# EAGLE schematic cft (EAGLE 5.11), part 3 of 7
## Sheet 21 of 49
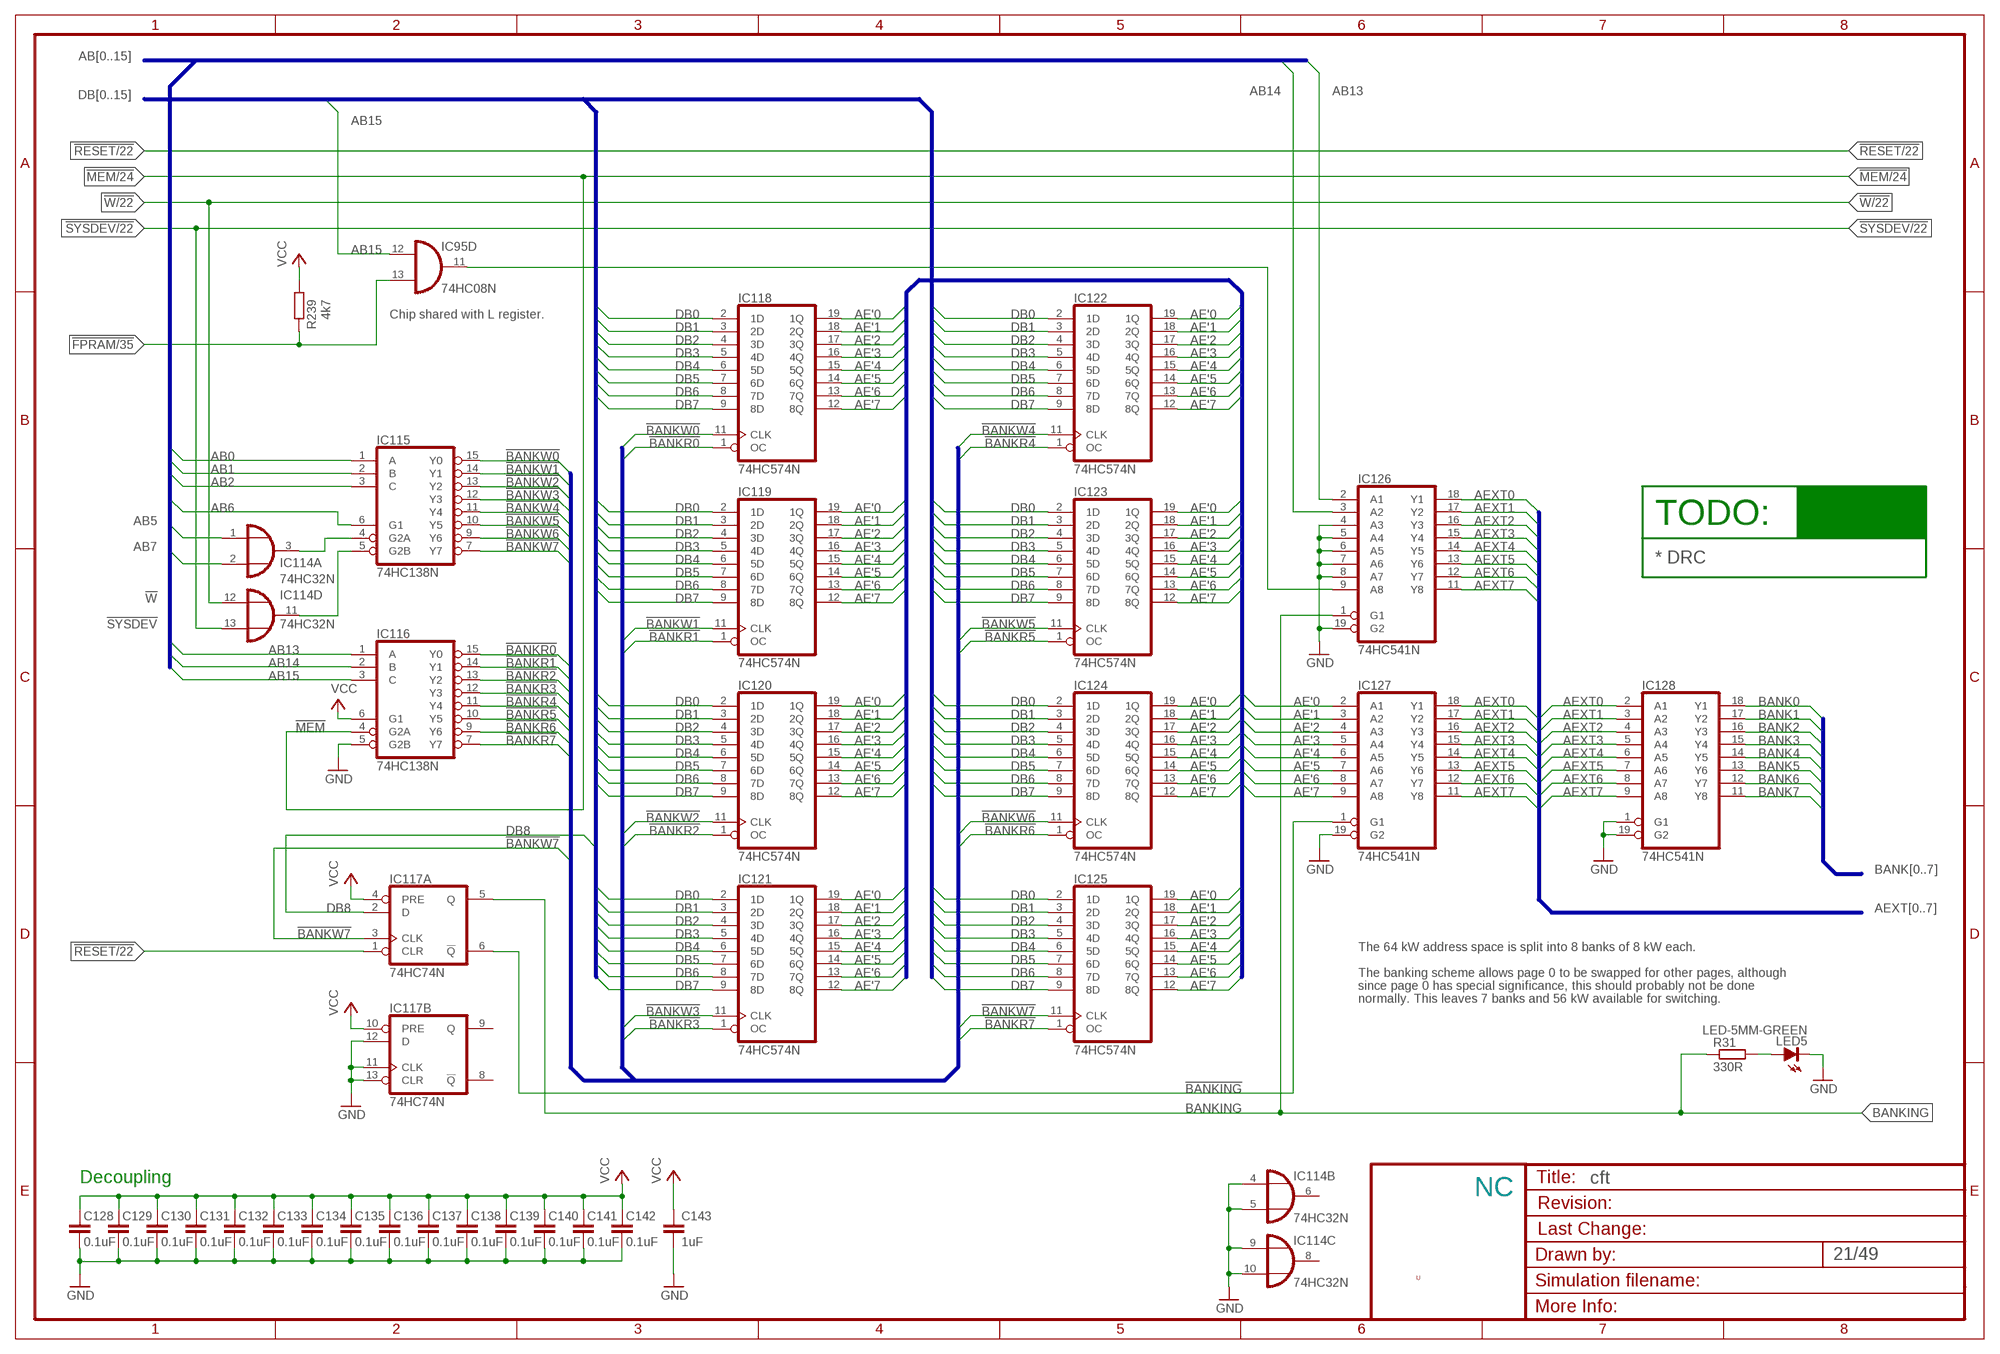
[diagram p20: schematic, sheet 21]

### Parts
C128  0.1uF  C-EU025-024X044  [C025-024X044]
C129  0.1uF  C-EU025-024X044  [C025-024X044]
C130  0.1uF  C-EU025-024X044  [C025-024X044]
C131  0.1uF  C-EU025-024X044  [C025-024X044]
C132  0.1uF  C-EU025-024X044  [C025-024X044]
C133  0.1uF  C-EU025-024X044  [C025-024X044]
C134  0.1uF  C-EU025-024X044  [C025-024X044]
C135  0.1uF  C-EU025-024X044  [C025-024X044]
C136  0.1uF  C-EU025-024X044  [C025-024X044]
C137  0.1uF  C-EU025-024X044  [C025-024X044]
C138  0.1uF  C-EU025-024X044  [C025-024X044]
C139  0.1uF  C-EU025-024X044  [C025-024X044]
C140  0.1uF  C-EU025-024X044  [C025-024X044]
C141  0.1uF  C-EU025-024X044  [C025-024X044]
C142  0.1uF  C-EU025-024X044  [C025-024X044]
C143  1uF  C-EU025-024X044  [C025-024X044]
IC114  74HC32N  [DIL14]
IC115  74HC138N  [DIL16]
IC116  74HC138N  [DIL16]
IC117  74HC74N  [DIL14]
IC118  74HC574N  [DIL20]
IC119  74HC574N  [DIL20]
IC120  74HC574N  [DIL20]
IC121  74HC574N  [DIL20]
IC122  74HC574N  [DIL20]
IC123  74HC574N  [DIL20]
IC124  74HC574N  [DIL20]
IC125  74HC574N  [DIL20]
IC126  74HC541N  [DIL20]
IC127  74HC541N  [DIL20]
IC128  74HC541N  [DIL20]
LED5  LED-5MM-GREEN  [LED5MM]
R31  330R  R-EU_0204/7  [0204/7]
R239  4k7  R-EU_0204/7  [0204/7]

### Nets
!BANKING: IC117.6(A:!Q) IC127.1(G1)
!BANKR0: IC116.15(Y0) IC118.1(OC)
!BANKR1: IC116.14(Y1) IC119.1(OC)
!BANKR2: IC116.13(Y2) IC120.1(OC)
!BANKR3: IC116.12(Y3) IC121.1(OC)
!BANKR4: IC116.11(Y4) IC122.1(OC)
!BANKR5: IC116.10(Y5) IC123.1(OC)
!BANKR6: IC116.9(Y6) IC124.1(OC)
!BANKR7: IC116.7(Y7) IC125.1(OC)
!BANKW0: IC115.15(Y0) IC118.11(CLK)
!BANKW1: IC115.14(Y1) IC119.11(CLK)
!BANKW2: IC115.13(Y2) IC120.11(CLK)
!BANKW3: IC115.12(Y3) IC121.11(CLK)
!BANKW4: IC115.11(Y4) IC122.11(CLK)
!BANKW5: IC115.10(Y5) IC123.11(CLK)
!BANKW6: IC115.9(Y6) IC124.11(CLK)
!BANKW7: IC115.7(Y7) IC117.3(A:CLK) IC125.11(CLK)
!FPRAM: IC95.13(D:I1) R239.1 ; also sheet 35,40
!MEM: IC116.4(G2A) ; also sheet 4,5,6,12,13,24,42,44,45,46
!RESET: IC117.1(A:CLR) ; also sheet 2,3,4,7,8,10,11,12,13,14,17,18,19,20,22,25,26,28,29,30,31,44,45,46,47
!SYSDEV: IC114.13(D:I1) ; also sheet 13,22,25,26,27,28,29,30,41,44,45,46
!W: IC114.12(D:I0) ; also sheet 12,22,24,25,26,27,28,29,30,41,44,45,46,47,48
AB0: IC115.1(A) ; also sheet 13,24,25,26,27,28,29,30,41,44,45,46,47,48
AB1: IC115.2(B) ; also sheet 13,24,25,26,27,28,29,30,41,44,45,46,47,48
AB2: IC115.3(C) ; also sheet 13,24,25,26,27,29,30,41,44,45,46,47,48
AB5: IC114.1(A:I0) ; also sheet 13,22,24,25,26,27,28,29,30,41,44,45,46,47,48
AB6: IC115.6(G1) ; also sheet 13,22,24,25,26,27,28,29,30,41,44,45,46,47,48
AB7: IC114.2(A:I1) ; also sheet 13,22,24,25,26,27,28,29,30,41,44,45,46,47,48
AB13: IC116.1(A) IC126.2(A1) ; also sheet 13,44,45,46
AB14: IC116.2(B) IC126.3(A2) ; also sheet 13,44,45,46
AB15: IC95.12(D:I0) IC116.3(C) ; also sheet 13,44,45,46
AE'0: IC118.19(1Q) IC119.19(1Q) IC120.19(1Q) IC121.19(1Q) IC122.19(1Q) IC123.19(1Q) IC124.19(1Q) IC125.19(1Q) IC127.2(A1)
AE'1: IC118.18(2Q) IC119.18(2Q) IC120.18(2Q) IC121.18(2Q) IC122.18(2Q) IC123.18(2Q) IC124.18(2Q) IC125.18(2Q) IC127.3(A2)
AE'2: IC118.17(3Q) IC119.17(3Q) IC120.17(3Q) IC121.17(3Q) IC122.17(3Q) IC123.17(3Q) IC124.17(3Q) IC125.17(3Q) IC127.4(A3)
AE'3: IC118.16(4Q) IC119.16(4Q) IC120.16(4Q) IC121.16(4Q) IC122.16(4Q) IC123.16(4Q) IC124.16(4Q) IC125.16(4Q) IC127.5(A4)
AE'4: IC118.15(5Q) IC119.15(5Q) IC120.15(5Q) IC121.15(5Q) IC122.15(5Q) IC123.15(5Q) IC124.15(5Q) IC125.15(5Q) IC127.6(A5)
AE'5: IC118.14(6Q) IC119.14(6Q) IC120.14(6Q) IC121.14(6Q) IC122.14(6Q) IC123.14(6Q) IC124.14(6Q) IC125.14(6Q) IC127.7(A6)
AE'6: IC118.13(7Q) IC119.13(7Q) IC120.13(7Q) IC121.13(7Q) IC122.13(7Q) IC123.13(7Q) IC124.13(7Q) IC125.13(7Q) IC127.8(A7)
AE'7: IC118.12(8Q) IC119.12(8Q) IC120.12(8Q) IC121.12(8Q) IC122.12(8Q) IC123.12(8Q) IC124.12(8Q) IC125.12(8Q) IC127.9(A8)
AEXT0: IC126.18(Y1) IC127.18(Y1) IC128.2(A1) ; also sheet 24,44,45,46
AEXT1: IC126.17(Y2) IC127.17(Y2) IC128.3(A2) ; also sheet 24,44,45,46
AEXT2: IC126.16(Y3) IC127.16(Y3) IC128.4(A3) ; also sheet 24,44,45,46
AEXT3: IC126.15(Y4) IC127.15(Y4) IC128.5(A4) ; also sheet 24,44,45,46
AEXT4: IC126.14(Y5) IC127.14(Y5) IC128.6(A5) ; also sheet 24,44,45,46
AEXT5: IC126.13(Y6) IC127.13(Y6) IC128.7(A6) ; also sheet 24,44,45,46
AEXT6: IC126.12(Y7) IC127.12(Y7) IC128.8(A7) ; also sheet 24,44,45,46
AEXT7: IC126.11(Y8) IC127.11(Y8) IC128.9(A8) ; also sheet 24,44,45,46
BANK0: IC128.18(Y1) ; also sheet 32
BANK1: IC128.17(Y2) ; also sheet 32
BANK2: IC128.16(Y3) ; also sheet 32
BANK3: IC128.15(Y4) ; also sheet 32
BANK4: IC128.14(Y5) ; also sheet 32
BANK5: IC128.13(Y6) ; also sheet 32
BANK6: IC128.12(Y7) ; also sheet 32
BANK7: IC128.11(Y8) ; also sheet 32
BANKING: IC117.5(A:Q) IC126.1(G1) R31.1 ; also sheet 32
DB0: IC118.2(1D) IC119.2(1D) IC120.2(1D) IC121.2(1D) IC122.2(1D) IC123.2(1D) IC124.2(1D) IC125.2(1D) ; also sheet 12,22,24,25,26,27,28,29,30,31,41,44,45,46,47,48
DB1: IC118.3(2D) IC119.3(2D) IC120.3(2D) IC121.3(2D) IC122.3(2D) IC123.3(2D) IC124.3(2D) IC125.3(2D) ; also sheet 12,22,24,25,26,27,28,29,30,31,41,44,45,46,47,48
DB2: IC118.4(3D) IC119.4(3D) IC120.4(3D) IC121.4(3D) IC122.4(3D) IC123.4(3D) IC124.4(3D) IC125.4(3D) ; also sheet 12,22,24,25,26,27,28,29,30,31,41,44,45,46,47,48
DB3: IC118.5(4D) IC119.5(4D) IC120.5(4D) IC121.5(4D) IC122.5(4D) IC123.5(4D) IC124.5(4D) IC125.5(4D) ; also sheet 12,22,24,25,26,27,28,29,30,31,41,44,45,46,47,48
DB4: IC118.6(5D) IC119.6(5D) IC120.6(5D) IC121.6(5D) IC122.6(5D) IC123.6(5D) IC124.6(5D) IC125.6(5D) ; also sheet 12,22,24,25,26,27,28,29,30,31,41,44,45,46,47,48
DB5: IC118.7(6D) IC119.7(6D) IC120.7(6D) IC121.7(6D) IC122.7(6D) IC123.7(6D) IC124.7(6D) IC125.7(6D) ; also sheet 12,22,24,25,26,27,28,29,30,31,41,44,45,46,47,48
DB6: IC118.8(7D) IC119.8(7D) IC120.8(7D) IC121.8(7D) IC122.8(7D) IC123.8(7D) IC124.8(7D) IC125.8(7D) ; also sheet 12,22,24,25,26,27,28,29,30,31,41,44,45,46,47,48
DB7: IC118.9(8D) IC119.9(8D) IC120.9(8D) IC121.9(8D) IC122.9(8D) IC123.9(8D) IC124.9(8D) IC125.9(8D) ; also sheet 12,22,24,25,26,27,28,29,30,31,41,44,45,46,47,48
DB8: IC117.2(A:D) ; also sheet 12,24,26,27,29,30,31,41,44,45,46,48
GND [low power]: C128.1 C129.1 C130.1 C131.1 C132.1 C133.1 C134.1 C135.1 C136.1 C137.1 C138.1 C139.1 C140.1 C141.1 C142.1 C143.2 IC114.4(B:I0) IC114.5(B:I1) IC114.9(C:I0) IC114.10(C:I1) IC116.5(G2B) IC117.11(B:CLK) IC117.12(B:D) IC117.13(B:CLR) IC126.4(A3) IC126.5(A4) IC126.6(A5) IC126.7(A6) IC126.8(A7) IC126.19(G2) IC127.19(G2) IC128.1(G1) IC128.19(G2) LED5.K(C) ; also sheet 2,3,4,5,6,7,8,9,10,11,12,13,14,15,16,17,18,19,20,22,24,25,26,27,28,29,30,31,32,33,34,35,36,37,38,39,40,41,42,43,44,45,46,47,48,49
N$339: IC114.3(A:O) IC115.4(G2A)
N$340: IC114.11(D:O) IC115.5(G2B)
N$341: LED5.A R31.2
N$919: IC95.11(D:O) IC126.9(A8)
VCC [low power]: C128.2 C129.2 C130.2 C131.2 C132.2 C133.2 C134.2 C135.2 C136.2 C137.2 C138.2 C139.2 C140.2 C141.2 C142.2 C143.1 IC116.6(G1) IC117.4(A:PRE) IC117.10(B:PRE) R239.2 ; also sheet 2,3,4,6,7,8,9,10,11,12,13,14,15,16,17,18,19,20,22,24,25,26,27,28,29,30,31,34,35,36,37,38,39,40,41,42,43,44,45,46,47,48,49
Unconnected: IC114.6(B:O) IC114.8(C:O) IC117.8(B:!Q) IC117.9(B:Q)

### Buses
AB[0..15]
DB[0..15]
AE'[0..7]
AEXT[0..7]
BANK[0..7]
!BANKW[0..7],!BANKR[0..7],!BANKEN

### Notes on the sheet
- Chip shared with L register.
- TODO:
- * DRC
- The 64 kW address space is split into 8 banks of 8 kW each.
- The banking scheme allows page 0 to be swapped for other pages, although
- since page 0 has special significance, this should probably not be done
- normally. This leaves 7 banks and 56 kW available for switching.
- Decoupling
- NC
- U

## Sheet 22 of 49
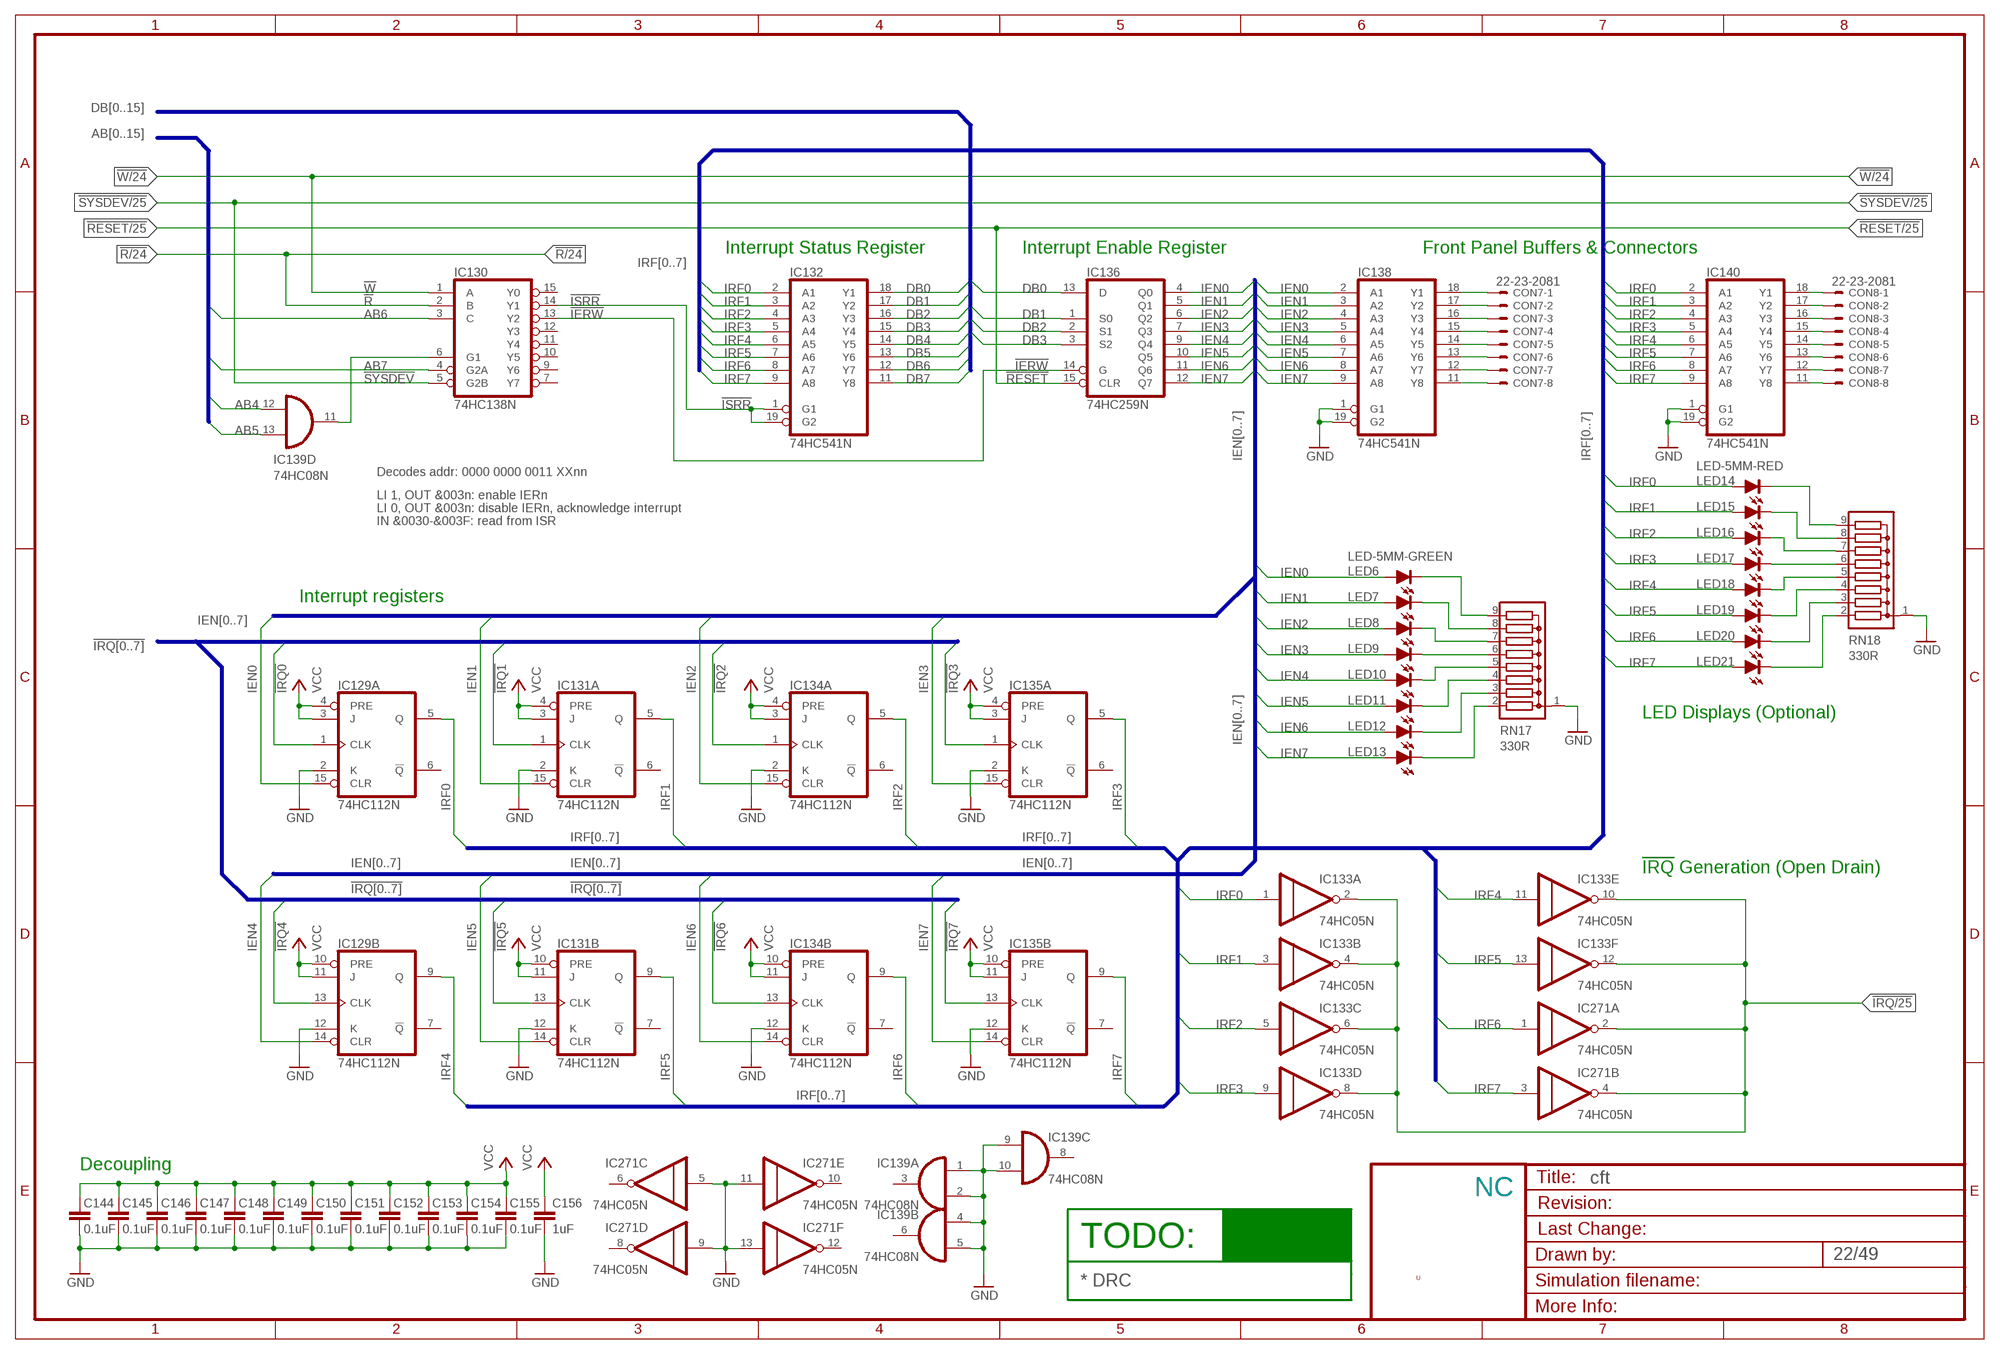
[diagram p21: schematic, sheet 22]

### Parts
C144  0.1uF  C-EU025-024X044  [C025-024X044]
C145  0.1uF  C-EU025-024X044  [C025-024X044]
C146  0.1uF  C-EU025-024X044  [C025-024X044]
C147  0.1uF  C-EU025-024X044  [C025-024X044]
C148  0.1uF  C-EU025-024X044  [C025-024X044]
C149  0.1uF  C-EU025-024X044  [C025-024X044]
C150  0.1uF  C-EU025-024X044  [C025-024X044]
C151  0.1uF  C-EU025-024X044  [C025-024X044]
C152  0.1uF  C-EU025-024X044  [C025-024X044]
C153  0.1uF  C-EU025-024X044  [C025-024X044]
C154  0.1uF  C-EU025-024X044  [C025-024X044]
C155  0.1uF  C-EU025-024X044  [C025-024X044]
C156  1uF  C-EU025-024X044  [C025-024X044]
CON7  22-23-2081  [22-23-2081]
CON8  22-23-2081  [22-23-2081]
IC129  74HC112N  [DIL16]
IC130  74HC138N  [DIL16]
IC131  74HC112N  [DIL16]
IC132  74HC541N  [DIL20]
IC133  74HC05N  [DIL14]
IC134  74HC112N  [DIL16]
IC135  74HC112N  [DIL16]
IC136  74HC259N  [DIL16]
IC138  74HC541N  [DIL20]
IC139  74HC08N  [DIL14]
IC140  74HC541N  [DIL20]
IC271  74HC05N  [DIL14]
LED6  LED-5MM-GREEN  [LED5MM]
LED7  LED-5MM-GREEN  [LED5MM]
LED8  LED-5MM-GREEN  [LED5MM]
LED9  LED-5MM-GREEN  [LED5MM]
LED10  LED-5MM-GREEN  [LED5MM]
LED11  LED-5MM-GREEN  [LED5MM]
LED12  LED-5MM-GREEN  [LED5MM]
LED13  LED-5MM-GREEN  [LED5MM]
LED14  LED-5MM-RED  [LED5MM]
LED15  LED-5MM-RED  [LED5MM]
LED16  LED-5MM-RED  [LED5MM]
LED17  LED-5MM-RED  [LED5MM]
LED18  LED-5MM-RED  [LED5MM]
LED19  LED-5MM-RED  [LED5MM]
LED20  LED-5MM-RED  [LED5MM]
LED21  LED-5MM-RED  [LED5MM]
RN17  330R  G08R  [SIL9]
RN18  330R  G08R  [SIL9]

### Nets
!IERW: IC130.13(Y2) IC136.14(G)
!IRQ: IC133.2(A:O) IC133.4(B:O) IC133.6(C:O) IC133.8(D:O) IC133.10(E:O) IC133.12(F:O) IC271.2(A:O) IC271.4(B:O) ; also sheet 11,25,26,27,28,29,30,44,47
!IRQ0: IC129.1(A:CLK) ; also sheet 25,27,30,44,45,46
!IRQ1: IC131.1(A:CLK) ; also sheet 25,27,30,44,45,46
!IRQ2: IC134.1(A:CLK) ; also sheet 25,27,29,30,44,45,46,47
!IRQ3: IC135.1(A:CLK) ; also sheet 25,29,30,44,45,46,47
!IRQ4: IC129.13(B:CLK) ; also sheet 25,29,30,44,45,46,47
!IRQ5: IC131.13(B:CLK) ; also sheet 25,26,28,30,44,45,46
!IRQ6: IC134.13(B:CLK) ; also sheet 25,26,28,30,44,45,46
!IRQ7: IC135.13(B:CLK) ; also sheet 25,26,28,30,44,45,46
!ISRR: IC130.14(Y1) IC132.1(G1) IC132.19(G2)
!R: IC130.2(B) ; also sheet 4,5,6,12,24,25,26,27,28,29,30,41,42,44,45,46,47,48
!RESET: IC136.15(CLR) ; also sheet 2,3,4,7,8,10,11,12,13,14,17,18,19,20,21,25,26,28,29,30,31,44,45,46,47
!SYSDEV: IC130.5(G2B) ; also sheet 13,21,25,26,27,28,29,30,41,44,45,46
!W: IC130.1(A) ; also sheet 12,21,24,25,26,27,28,29,30,41,44,45,46,47,48
AB4: IC139.12(D:I0) ; also sheet 13,24,25,26,27,28,29,30,41,44,45,46,47,48
AB5: IC139.13(D:I1) ; also sheet 13,21,24,25,26,27,28,29,30,41,44,45,46,47,48
AB6: IC130.3(C) ; also sheet 13,21,24,25,26,27,28,29,30,41,44,45,46,47,48
AB7: IC130.4(G2A) ; also sheet 13,21,24,25,26,27,28,29,30,41,44,45,46,47,48
DB0: IC132.18(Y1) IC136.13(D) ; also sheet 12,21,24,25,26,27,28,29,30,31,41,44,45,46,47,48
DB1: IC132.17(Y2) IC136.1(S0) ; also sheet 12,21,24,25,26,27,28,29,30,31,41,44,45,46,47,48
DB2: IC132.16(Y3) IC136.2(S1) ; also sheet 12,21,24,25,26,27,28,29,30,31,41,44,45,46,47,48
DB3: IC132.15(Y4) IC136.3(S2) ; also sheet 12,21,24,25,26,27,28,29,30,31,41,44,45,46,47,48
DB4: IC132.14(Y5) ; also sheet 12,21,24,25,26,27,28,29,30,31,41,44,45,46,47,48
DB5: IC132.13(Y6) ; also sheet 12,21,24,25,26,27,28,29,30,31,41,44,45,46,47,48
DB6: IC132.12(Y7) ; also sheet 12,21,24,25,26,27,28,29,30,31,41,44,45,46,47,48
DB7: IC132.11(Y8) ; also sheet 12,21,24,25,26,27,28,29,30,31,41,44,45,46,47,48
FPIEN0: CON7.1 IC138.18(Y1)
FPIEN1: CON7.2 IC138.17(Y2)
FPIEN2: CON7.3 IC138.16(Y3)
FPIEN3: CON7.4 IC138.15(Y4)
FPIEN4: CON7.5 IC138.14(Y5)
FPIEN5: CON7.6 IC138.13(Y6)
FPIEN6: CON7.7 IC138.12(Y7)
FPIEN7: CON7.8 IC138.11(Y8)
FPIEN8: CON8.1 IC140.18(Y1)
FPIEN9: CON8.2 IC140.17(Y2)
FPIEN10: CON8.3 IC140.16(Y3)
FPIEN11: CON8.4 IC140.15(Y4)
FPIEN12: CON8.5 IC140.14(Y5)
FPIEN13: CON8.6 IC140.13(Y6)
FPIEN14: CON8.7 IC140.12(Y7)
FPIEN15: CON8.8 IC140.11(Y8)
GND [low power]: C144.1 C145.1 C146.1 C147.1 C148.1 C149.1 C150.1 C151.1 C152.1 C153.1 C154.1 C155.1 C156.2 IC129.2(A:K) IC129.12(B:K) IC131.2(A:K) IC131.12(B:K) IC134.2(A:K) IC134.12(B:K) IC135.2(A:K) IC135.12(B:K) IC138.1(G1) IC138.19(G2) IC139.1(A:I0) IC139.2(A:I1) IC139.4(B:I0) IC139.5(B:I1) IC139.9(C:I0) IC139.10(C:I1) IC140.1(G1) IC140.19(G2) IC271.5(C:I) IC271.9(D:I) IC271.11(E:I) IC271.13(F:I) RN17.1 RN18.1 ; also sheet 2,3,4,5,6,7,8,9,10,11,12,13,14,15,16,17,18,19,20,21,24,25,26,27,28,29,30,31,32,33,34,35,36,37,38,39,40,41,42,43,44,45,46,47,48,49
IEN0: IC129.15(A:CLR) IC136.4(Q0) IC138.2(A1) LED6.A
IEN1: IC131.15(A:CLR) IC136.5(Q1) IC138.3(A2) LED7.A
IEN2: IC134.15(A:CLR) IC136.6(Q2) IC138.4(A3) LED8.A
IEN3: IC135.15(A:CLR) IC136.7(Q3) IC138.5(A4) LED9.A
IEN4: IC129.14(B:CLR) IC136.9(Q4) IC138.6(A5) LED10.A
IEN5: IC131.14(B:CLR) IC136.10(Q5) IC138.7(A6) LED11.A
IEN6: IC134.14(B:CLR) IC136.11(Q6) IC138.8(A7) LED12.A
IEN7: IC135.14(B:CLR) IC136.12(Q7) IC138.9(A8) LED13.A
IRF0: IC129.5(A:Q) IC132.2(A1) IC133.1(A:I) IC140.2(A1) LED14.A
IRF1: IC131.5(A:Q) IC132.3(A2) IC133.3(B:I) IC140.3(A2) LED15.A
IRF2: IC132.4(A3) IC133.5(C:I) IC134.5(A:Q) IC140.4(A3) LED16.A
IRF3: IC132.5(A4) IC133.9(D:I) IC135.5(A:Q) IC140.5(A4) LED17.A
IRF4: IC129.9(B:Q) IC132.6(A5) IC133.11(E:I) IC140.6(A5) LED18.A
IRF5: IC131.9(B:Q) IC132.7(A6) IC133.13(F:I) IC140.7(A6) LED19.A
IRF6: IC132.8(A7) IC134.9(B:Q) IC140.8(A7) IC271.1(A:I) LED20.A
IRF7: IC132.9(A8) IC135.9(B:Q) IC140.9(A8) IC271.3(B:I) LED21.A
N$3: LED9.K(C) RN17.6
N$4: LED8.K(C) RN17.7
N$5: LED7.K(C) RN17.8
N$6: LED6.K(C) RN17.9
N$56: LED10.K(C) RN17.5
N$57: LED11.K(C) RN17.4
N$58: LED12.K(C) RN17.3
N$59: LED13.K(C) RN17.2
N$60: LED17.K(C) RN18.6
N$62: LED16.K(C) RN18.7
N$63: LED15.K(C) RN18.8
N$64: LED14.K(C) RN18.9
N$65: LED18.K(C) RN18.5
N$120: LED19.K(C) RN18.4
N$121: LED20.K(C) RN18.3
N$122: LED21.K(C) RN18.2
N$381: IC130.6(G1) IC139.11(D:O)
VCC [low power]: C144.2 C145.2 C146.2 C147.2 C148.2 C149.2 C150.2 C151.2 C152.2 C153.2 C154.2 C155.2 C156.1 IC129.3(A:J) IC129.4(A:PRE) IC129.10(B:PRE) IC129.11(B:J) IC131.3(A:J) IC131.4(A:PRE) IC131.10(B:PRE) IC131.11(B:J) IC134.3(A:J) IC134.4(A:PRE) IC134.10(B:PRE) IC134.11(B:J) IC135.3(A:J) IC135.4(A:PRE) IC135.10(B:PRE) IC135.11(B:J) ; also sheet 2,3,4,6,7,8,9,10,11,12,13,14,15,16,17,18,19,20,21,24,25,26,27,28,29,30,31,34,35,36,37,38,39,40,41,42,43,44,45,46,47,48,49
Unconnected: IC129.6(A:!Q) IC129.7(B:!Q) IC130.7(Y7) IC130.9(Y6) IC130.10(Y5) IC130.11(Y4) IC130.12(Y3) IC130.15(Y0) IC131.6(A:!Q) IC131.7(B:!Q) IC134.6(A:!Q) IC134.7(B:!Q) IC135.6(A:!Q) IC135.7(B:!Q) IC139.3(A:O) IC139.6(B:O) IC139.8(C:O) IC271.6(C:O) IC271.8(D:O) IC271.10(E:O) IC271.12(F:O)

### Buses
AB[0..15]
DB[0..15]
!IRQ[0..7]
IEN[0..7]
IRF[0..7]

### Notes on the sheet
- Interrupt Status Register | Interrupt Enable Register | Front Panel Buffers & Connectors
- Decodes addr: 0000 0000 0011 XXnn
- LI 1, OUT &003n: enable IERn
- LI 0, OUT &003n: disable IERn, acknowledge interrupt
- IN &0030-&003F: read from ISR
- Interrupt registers
- LED Displays (Optional)
- !IRQ! Generation (Open Drain)
- Decoupling
- NC
- TODO:
- U
- * DRC

## Sheet 23 of 49
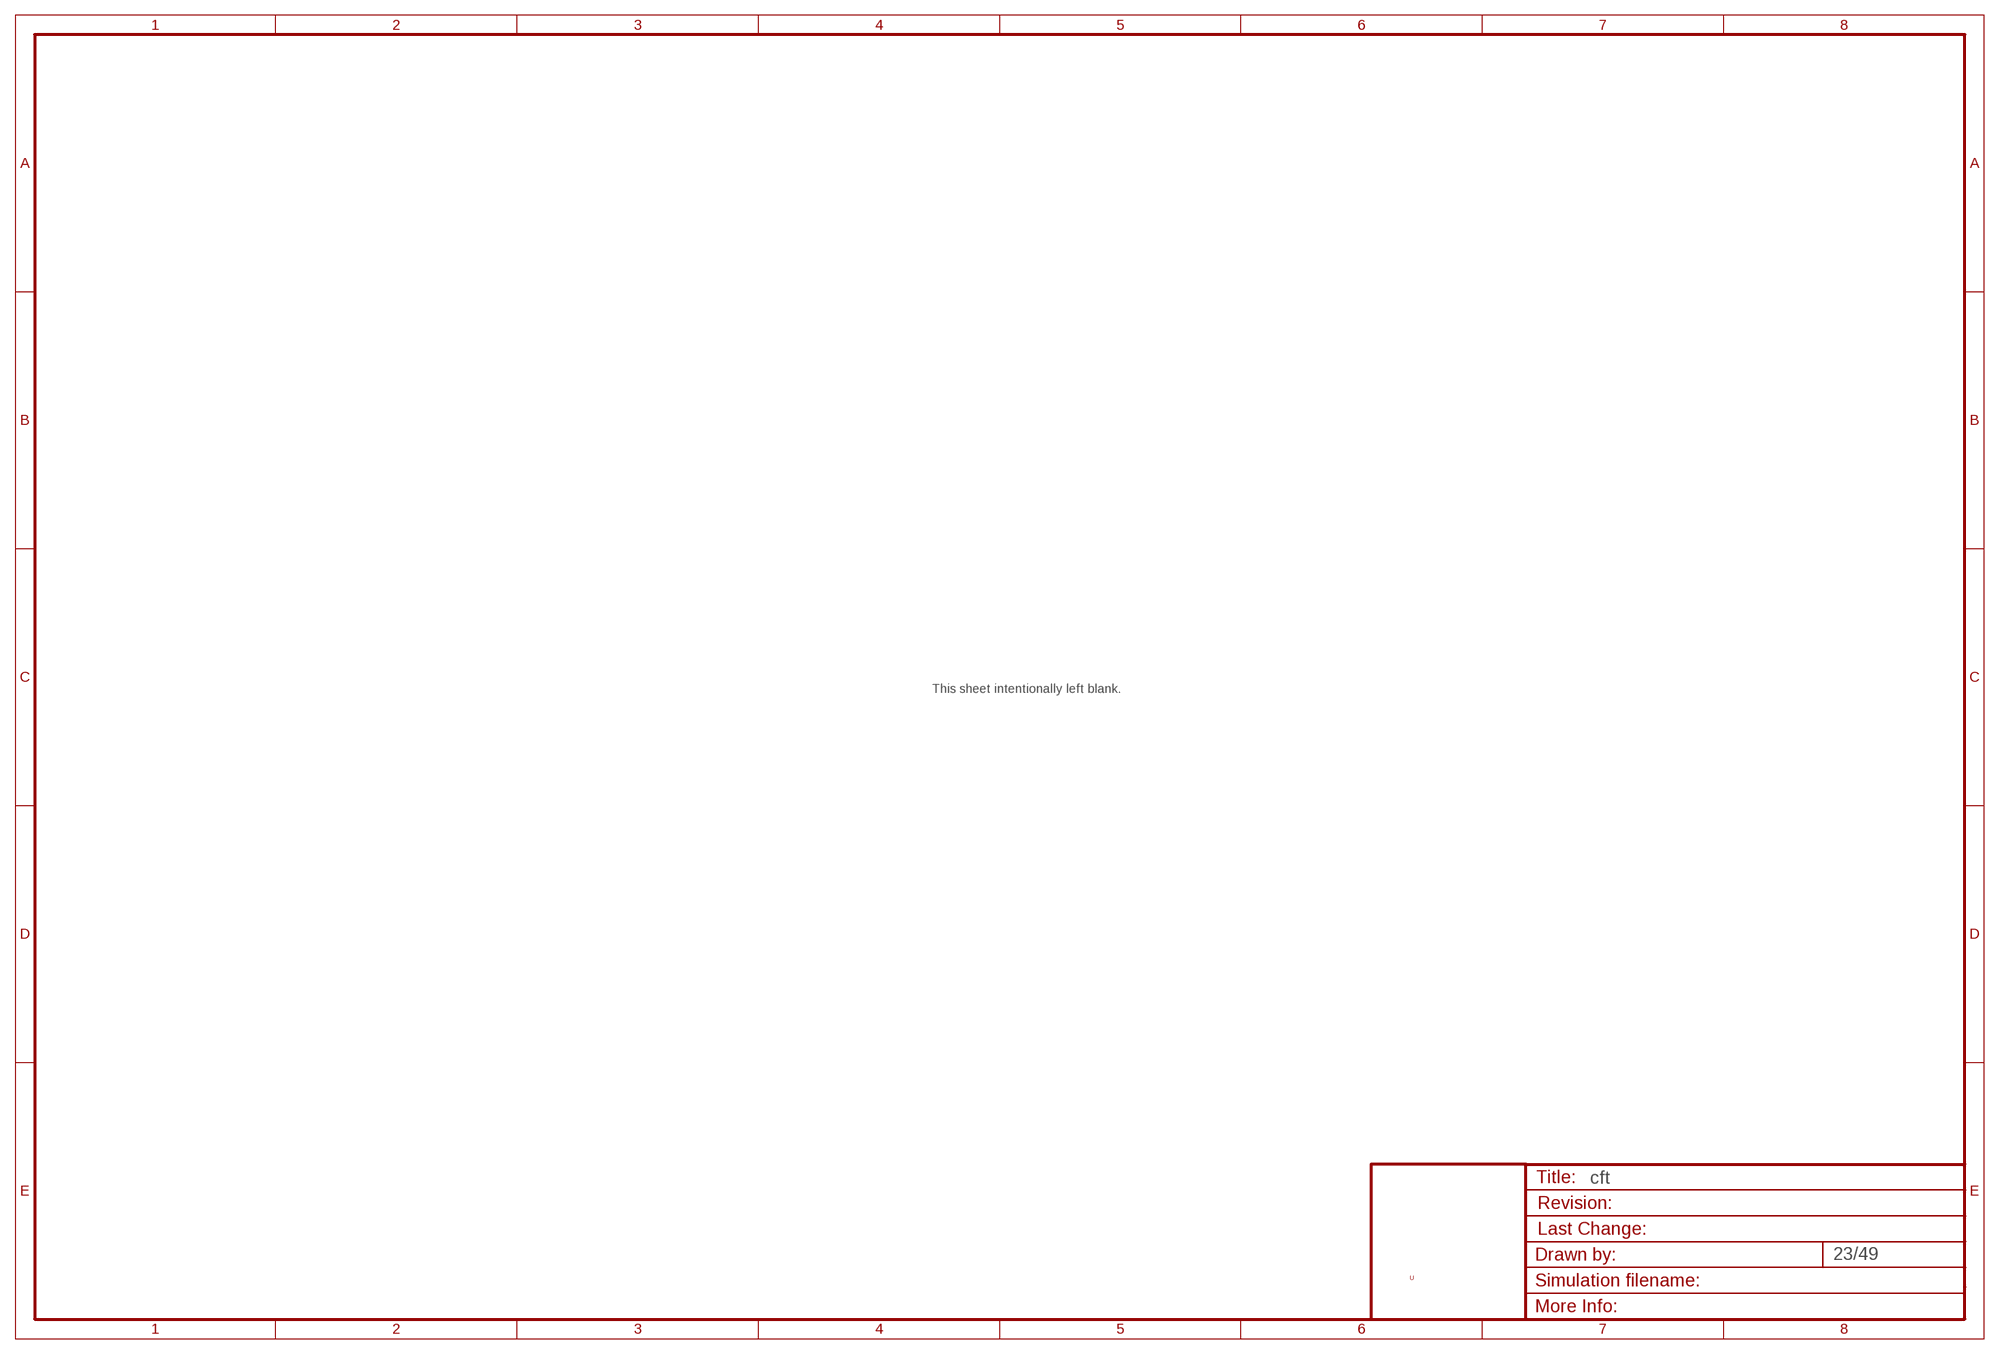
[diagram p22: schematic, sheet 23]

### Notes on the sheet
- This sheet intentionally left blank.
- U

## Sheet 24 of 49
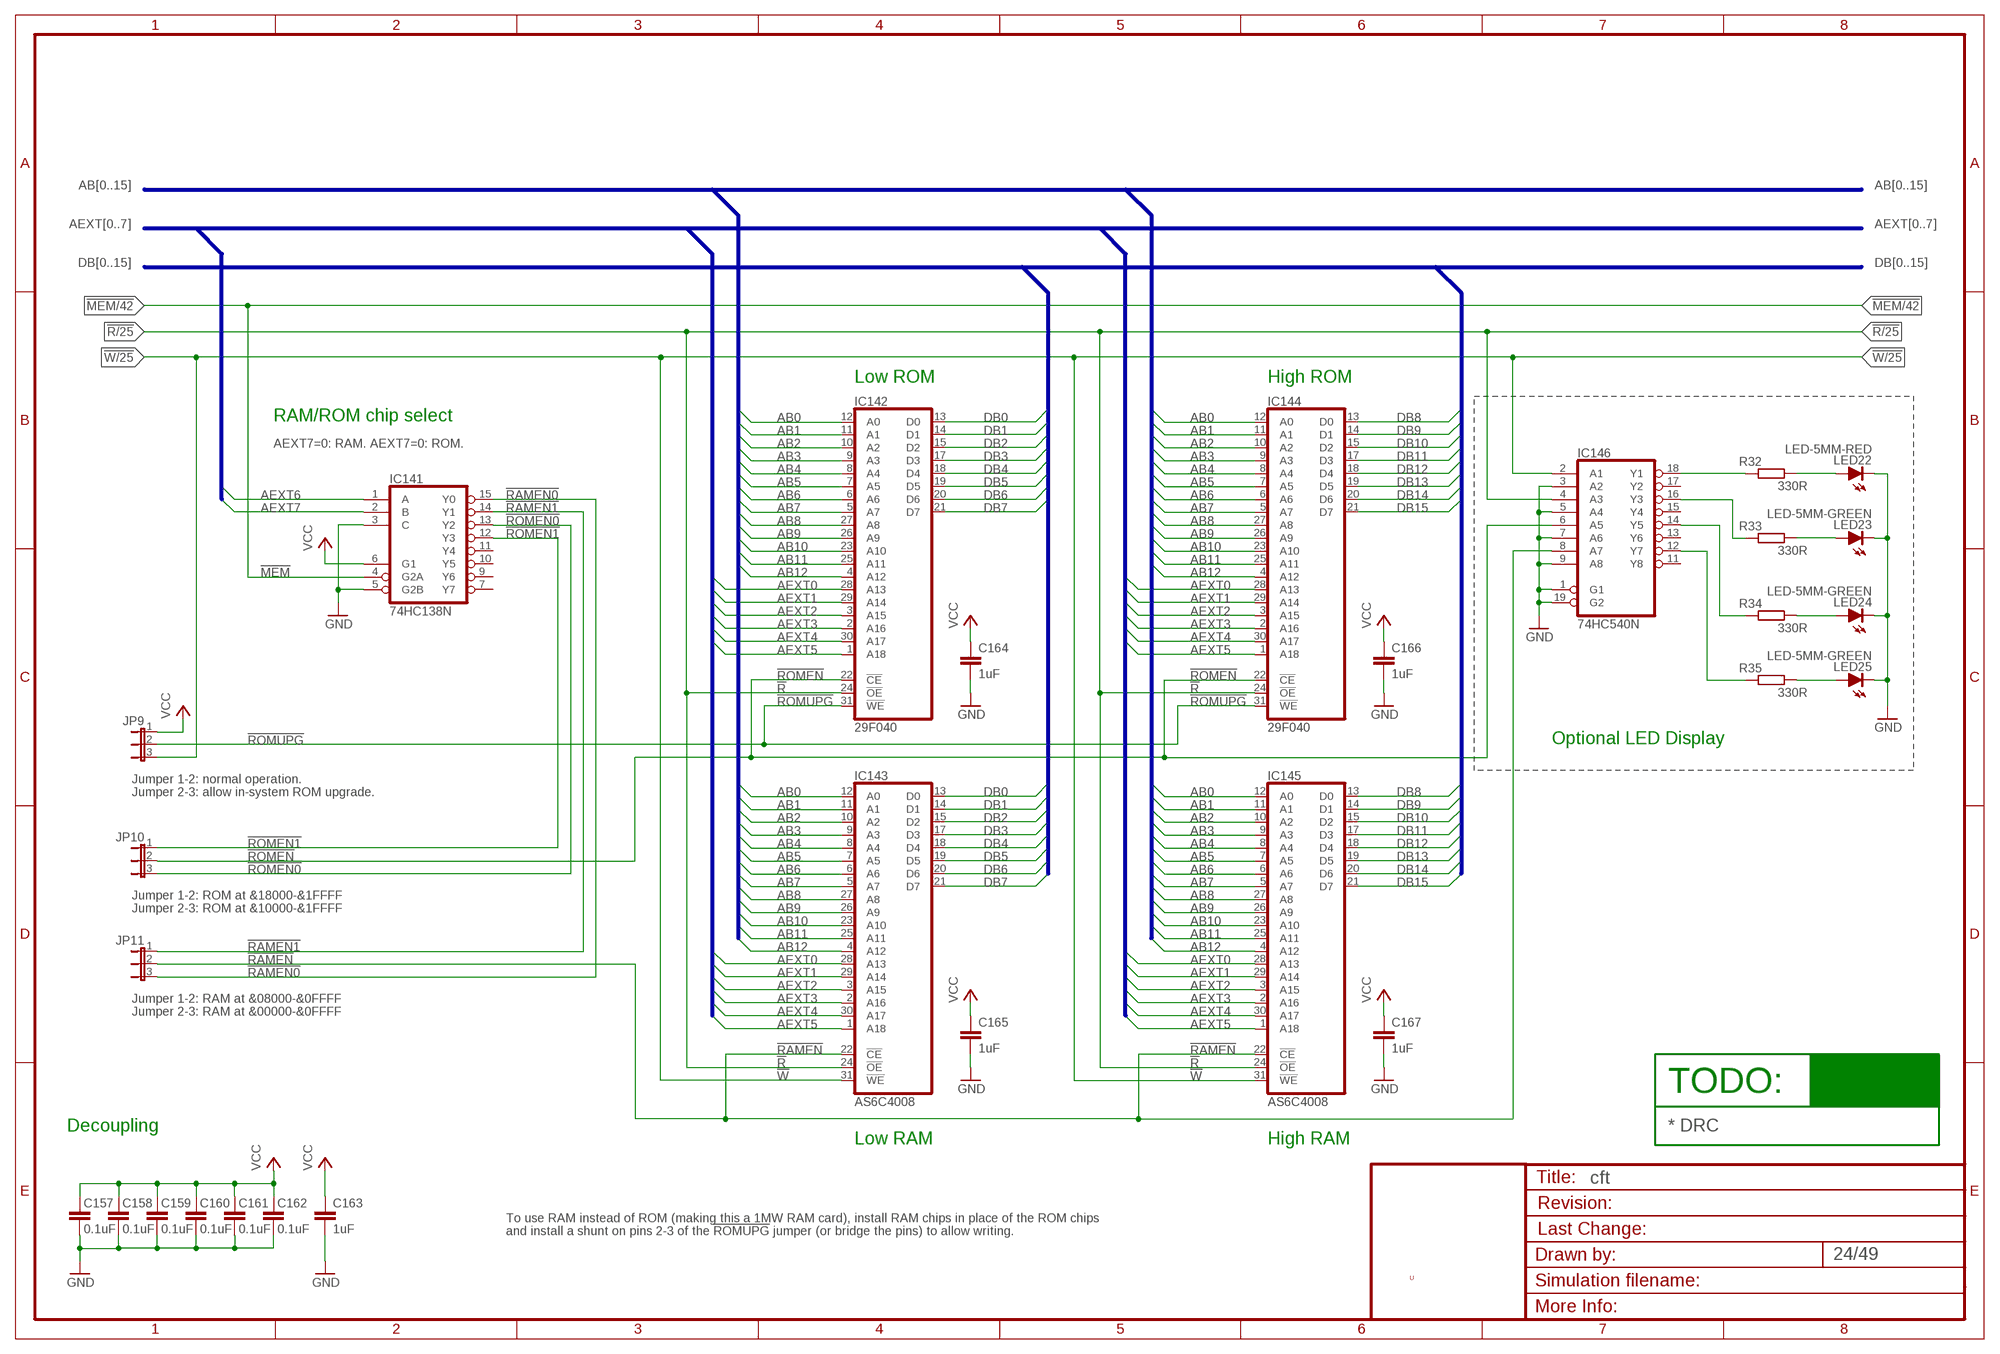
[diagram p23: schematic, sheet 24]

### Parts
C157  0.1uF  C-EU025-024X044  [C025-024X044]
C158  0.1uF  C-EU025-024X044  [C025-024X044]
C159  0.1uF  C-EU025-024X044  [C025-024X044]
C160  0.1uF  C-EU025-024X044  [C025-024X044]
C161  0.1uF  C-EU025-024X044  [C025-024X044]
C162  0.1uF  C-EU025-024X044  [C025-024X044]
C163  1uF  C-EU025-024X044  [C025-024X044]
C164  1uF  C-EU025-024X044  [C025-024X044]
C165  1uF  C-EU025-024X044  [C025-024X044]
C166  1uF  C-EU025-024X044  [C025-024X044]
C167  1uF  C-EU025-024X044  [C025-024X044]
IC141  74HC138N  [DIL16]
IC142  29F040  29F040PLCC32  [PLCC32]
IC143  AS6C4008  29F040DIP32  [DIL32]
IC144  29F040  29F040PLCC32  [PLCC32]
IC145  AS6C4008  29F040DIP32  [DIL32]
IC146  74HC540N  [DIL20]
JP9  JP2E  [JP2]
JP10  JP2E  [JP2]
JP11  JP2E  [JP2]
LED22  LED-5MM-RED  [LED5MM]
LED23  LED-5MM-GREEN  [LED5MM]
LED24  LED-5MM-GREEN  [LED5MM]
LED25  LED-5MM-GREEN  [LED5MM]
R32  330R  R-EU_0204/7  [0204/7]
R33  330R  R-EU_0204/7  [0204/7]
R34  330R  R-EU_0204/7  [0204/7]
R35  330R  R-EU_0204/7  [0204/7]

### Nets
!MEM: IC141.4(G2A) ; also sheet 4,5,6,12,13,21,42,44,45,46
!R: IC142.24(!OE) IC143.24(!OE) IC144.24(!OE) IC145.24(!OE) IC146.4(A3) ; also sheet 4,5,6,12,22,25,26,27,28,29,30,41,42,44,45,46,47,48
!RAMEN: IC143.22(!CE) IC145.22(!CE) IC146.8(A7) JP11.2
!RAMEN0: IC141.15(Y0) JP11.3
!RAMEN1: IC141.14(Y1) JP11.1
!ROMEN: IC142.22(!CE) IC144.22(!CE) IC146.6(A5) JP10.2
!ROMEN0: IC141.13(Y2) JP10.3
!ROMEN1: IC141.12(Y3) JP10.1
!ROMUPG: IC142.31(!WE) IC144.31(!WE) JP9.2
!W: IC143.31(!WE) IC145.31(!WE) IC146.2(A1) JP9.3 ; also sheet 12,21,22,25,26,27,28,29,30,41,44,45,46,47,48
AB0: IC142.12(A0) IC143.12(A0) IC144.12(A0) IC145.12(A0) ; also sheet 13,21,25,26,27,28,29,30,41,44,45,46,47,48
AB1: IC142.11(A1) IC143.11(A1) IC144.11(A1) IC145.11(A1) ; also sheet 13,21,25,26,27,28,29,30,41,44,45,46,47,48
AB2: IC142.10(A2) IC143.10(A2) IC144.10(A2) IC145.10(A2) ; also sheet 13,21,25,26,27,29,30,41,44,45,46,47,48
AB3: IC142.9(A3) IC143.9(A3) IC144.9(A3) IC145.9(A3) ; also sheet 13,25,26,27,28,29,30,41,44,45,46,47,48
AB4: IC142.8(A4) IC143.8(A4) IC144.8(A4) IC145.8(A4) ; also sheet 13,22,25,26,27,28,29,30,41,44,45,46,47,48
AB5: IC142.7(A5) IC143.7(A5) IC144.7(A5) IC145.7(A5) ; also sheet 13,21,22,25,26,27,28,29,30,41,44,45,46,47,48
AB6: IC142.6(A6) IC143.6(A6) IC144.6(A6) IC145.6(A6) ; also sheet 13,21,22,25,26,27,28,29,30,41,44,45,46,47,48
AB7: IC142.5(A7) IC143.5(A7) IC144.5(A7) IC145.5(A7) ; also sheet 13,21,22,25,26,27,28,29,30,41,44,45,46,47,48
AB8: IC142.27(A8) IC143.27(A8) IC144.27(A8) IC145.27(A8) ; also sheet 13,44,45,46
AB9: IC142.26(A9) IC143.26(A9) IC144.26(A9) IC145.26(A9) ; also sheet 13,44,45,46
AB10: IC142.23(A10) IC143.23(A10) IC144.23(A10) IC145.23(A10) ; also sheet 13,44,45,46
AB11: IC142.25(A11) IC143.25(A11) IC144.25(A11) IC145.25(A11) ; also sheet 13,44,45,46
AB12: IC142.4(A12) IC143.4(A12) IC144.4(A12) IC145.4(A12) ; also sheet 13,44,45,46
AEXT0: IC142.28(A13) IC143.28(A13) IC144.28(A13) IC145.28(A13) ; also sheet 21,44,45,46
AEXT1: IC142.29(A14) IC143.29(A14) IC144.29(A14) IC145.29(A14) ; also sheet 21,44,45,46
AEXT2: IC142.3(A15) IC143.3(A15) IC144.3(A15) IC145.3(A15) ; also sheet 21,44,45,46
AEXT3: IC142.2(A16) IC143.2(A16) IC144.2(A16) IC145.2(A16) ; also sheet 21,44,45,46
AEXT4: IC142.30(A17) IC143.30(A17) IC144.30(A17) IC145.30(A17) ; also sheet 21,44,45,46
AEXT5: IC142.1(A18) IC143.1(A18) IC144.1(A18) IC145.1(A18) ; also sheet 21,44,45,46
AEXT6: IC141.1(A) ; also sheet 21,44,45,46
AEXT7: IC141.2(B) ; also sheet 21,44,45,46
DB0: IC142.13(D0) IC143.13(D0) ; also sheet 12,21,22,25,26,27,28,29,30,31,41,44,45,46,47,48
DB1: IC142.14(D1) IC143.14(D1) ; also sheet 12,21,22,25,26,27,28,29,30,31,41,44,45,46,47,48
DB2: IC142.15(D2) IC143.15(D2) ; also sheet 12,21,22,25,26,27,28,29,30,31,41,44,45,46,47,48
DB3: IC142.17(D3) IC143.17(D3) ; also sheet 12,21,22,25,26,27,28,29,30,31,41,44,45,46,47,48
DB4: IC142.18(D4) IC143.18(D4) ; also sheet 12,21,22,25,26,27,28,29,30,31,41,44,45,46,47,48
DB5: IC142.19(D5) IC143.19(D5) ; also sheet 12,21,22,25,26,27,28,29,30,31,41,44,45,46,47,48
DB6: IC142.20(D6) IC143.20(D6) ; also sheet 12,21,22,25,26,27,28,29,30,31,41,44,45,46,47,48
DB7: IC142.21(D7) IC143.21(D7) ; also sheet 12,21,22,25,26,27,28,29,30,31,41,44,45,46,47,48
DB8: IC144.13(D0) IC145.13(D0) ; also sheet 12,21,26,27,29,30,31,41,44,45,46,48
DB9: IC144.14(D1) IC145.14(D1) ; also sheet 12,26,27,29,30,41,44,45,46,48
DB10: IC144.15(D2) IC145.15(D2) ; also sheet 12,26,27,29,30,41,44,45,46,48
DB11: IC144.17(D3) IC145.17(D3) ; also sheet 12,26,27,29,30,41,44,45,46,48
DB12: IC144.18(D4) IC145.18(D4) ; also sheet 12,26,27,29,30,41,44,45,46,48
DB13: IC144.19(D5) IC145.19(D5) ; also sheet 12,26,27,29,30,41,44,45,46,48
DB14: IC144.20(D6) IC145.20(D6) ; also sheet 12,26,27,29,30,41,44,45,46,48
DB15: IC144.21(D7) IC145.21(D7) ; also sheet 12,26,27,29,30,41,44,45,46,48
GND [low power]: C157.1 C158.1 C159.1 C160.1 C161.1 C162.1 C163.2 C164.2 C165.2 C166.2 C167.2 IC141.3(C) IC141.5(G2B) IC146.1(G1) IC146.3(A2) IC146.5(A4) IC146.7(A6) IC146.9(A8) IC146.19(G2) LED22.K(C) LED23.K(C) LED24.K(C) LED25.K(C) ; also sheet 2,3,4,5,6,7,8,9,10,11,12,13,14,15,16,17,18,19,20,21,22,25,26,27,28,29,30,31,32,33,34,35,36,37,38,39,40,41,42,43,44,45,46,47,48,49
N$104: LED22.A R32.2
N$136: IC146.18(Y1) R32.1
N$137: LED23.A R33.2
N$138: IC146.16(Y3) R33.1
N$139: LED24.A R34.2
N$140: IC146.14(Y5) R34.1
N$141: LED25.A R35.2
N$150: IC146.12(Y7) R35.1
VCC [low power]: C157.2 C158.2 C159.2 C160.2 C161.2 C162.2 C163.1 C164.1 C165.1 C166.1 C167.1 IC141.6(G1) JP9.1 ; also sheet 2,3,4,6,7,8,9,10,11,12,13,14,15,16,17,18,19,20,21,22,25,26,27,28,29,30,31,34,35,36,37,38,39,40,41,42,43,44,45,46,47,48,49
Unconnected: IC141.7(Y7) IC141.9(Y6) IC141.10(Y5) IC141.11(Y4) IC146.11(Y8) IC146.13(Y6) IC146.15(Y4) IC146.17(Y2)

### Buses
AB[0..15]
DB[0..15]
AEXT[0..7]

### Notes on the sheet
- Low ROM | High ROM
- RAM/ROM chip select
- AEXT7=0: RAM. AEXT7=0: ROM.
- Optional LED Display
- Jumper 1-2: normal operation.
- Jumper 2-3: allow in-system ROM upgrade.
- Jumper 1-2: ROM at &18000-&1FFFF
- Jumper 2-3: ROM at &10000-&1FFFF
- Jumper 1-2: RAM at &08000-&0FFFF
- Jumper 2-3: RAM at &00000-&0FFFF
- TODO:
- Decoupling | * DRC
- Low RAM | High RAM
- To use RAM instead of ROM (making this a 1MW RAM card), install RAM chips in place of the ROM chips
- and install a shunt on pins 2-3 of the !ROMUPG! jumper (or bridge the pins) to allow writing.
- U

## Sheet 25 of 49
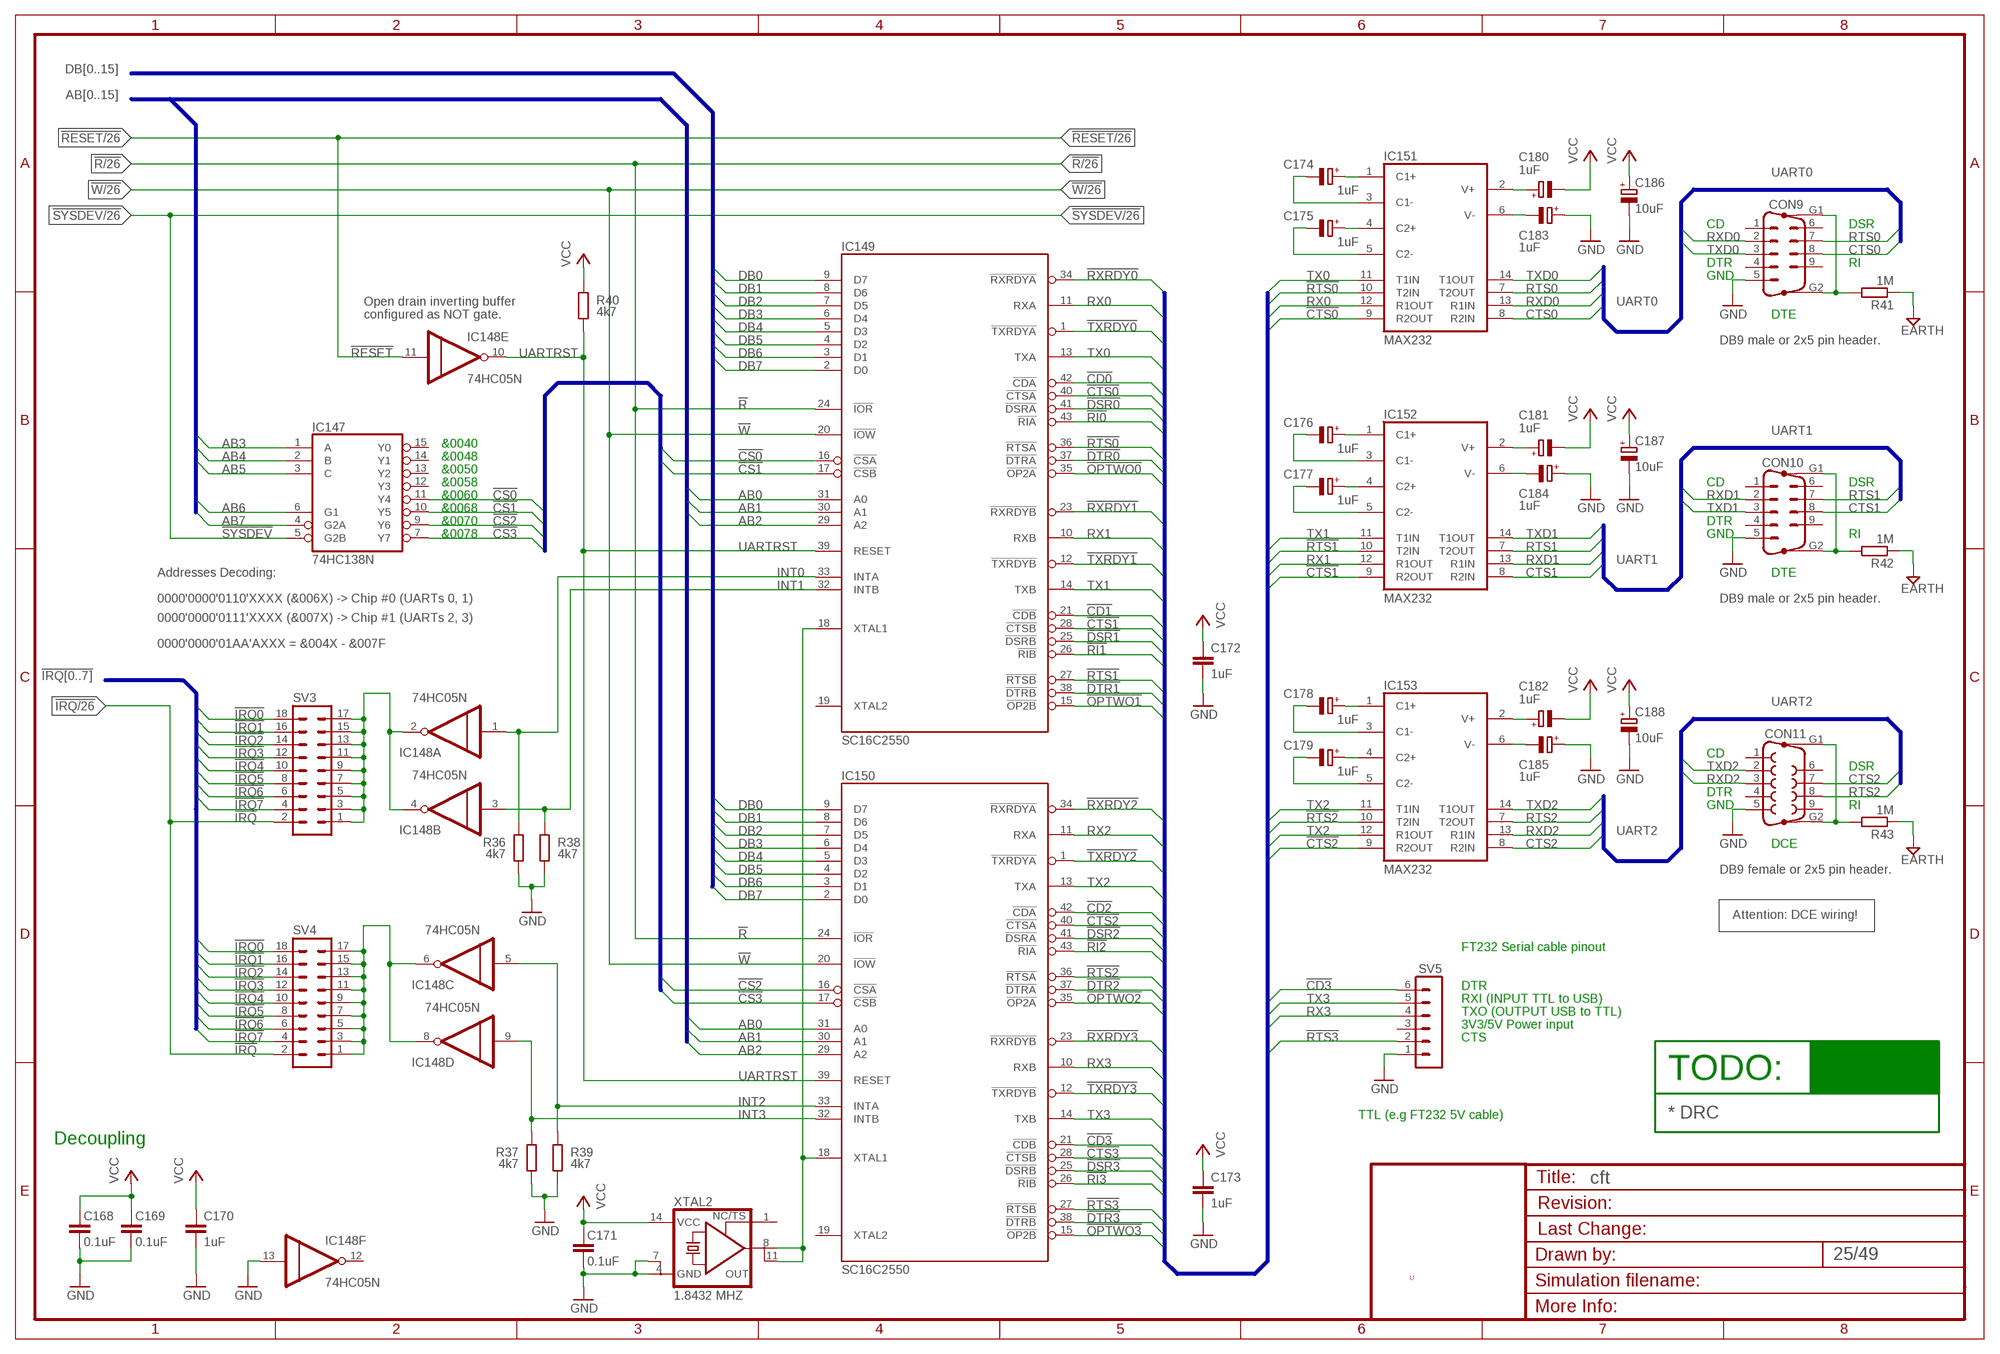
[diagram p24: schematic, sheet 25]

### Parts
C168  0.1uF  C-EU025-024X044  [C025-024X044]
C169  0.1uF  C-EU025-024X044  [C025-024X044]
C170  1uF  C-EU025-024X044  [C025-024X044]
C171  0.1uF  C-EU025-024X044  [C025-024X044]
C172  1uF  C-EU025-024X044  [C025-024X044]
C173  1uF  C-EU025-024X044  [C025-024X044]
C174  1uF  CPOL-EUE2.5-5  [E2,5-5]
C175  1uF  CPOL-EUE2.5-5  [E2,5-5]
C176  1uF  CPOL-EUE2.5-5  [E2,5-5]
C177  1uF  CPOL-EUE2.5-5  [E2,5-5]
C178  1uF  CPOL-EUE2.5-5  [E2,5-5]
C179  1uF  CPOL-EUE2.5-5  [E2,5-5]
C180  1uF  CPOL-EUE2.5-5  [E2,5-5]
C181  1uF  CPOL-EUE2.5-5  [E2,5-5]
C182  1uF  CPOL-EUE2.5-5  [E2,5-5]
C183  1uF  CPOL-EUE2.5-5  [E2,5-5]
C184  1uF  CPOL-EUE2.5-5  [E2,5-5]
C185  1uF  CPOL-EUE2.5-5  [E2,5-5]
C186  10uF  CPOL-EUE2.5-5  [E2,5-5]
C187  10uF  CPOL-EUE2.5-5  [E2,5-5]
C188  10uF  CPOL-EUE2.5-5  [E2,5-5]
CON9  M09HP  [M09HP]
CON10  M09HP  [M09HP]
CON11  F09VP  [F09VP]
IC147  74HC138N  [DIL16]
IC148  74HC05N  [DIL14]
IC149  SC16C2550  16C2550  [PLCC-S44-SOCKET]
IC150  SC16C2550  16C2550  [PLCC-S44-SOCKET]
IC151  MAX232  [DIL16]
IC152  MAX232  [DIL16]
IC153  MAX232  [DIL16]
R36  4k7  R-EU_0204/7  [0204/7]
R37  4k7  R-EU_0204/7  [0204/7]
R38  4k7  R-EU_0204/7  [0204/7]
R39  4k7  R-EU_0204/7  [0204/7]
R40  4k7  R-EU_0204/7  [0204/7]
R41  1M  R-EU_0204/7  [0204/7]
R42  1M  R-EU_0204/7  [0204/7]
R43  1M  R-EU_0204/7  [0204/7]
SV3  MA09-2  [MA09-2]
SV4  MA09-2  [MA09-2]
SV5  MA06-1  [MA06-1]
XTAL2  1.8432 MHZ  XO2-08-14-SOCKET  [DIL0814S]

### Nets
!CD0: IC149.42(!CDA)
!CD1: IC149.21(!CDB)
!CD2: IC150.42(!CDA)
!CD3: IC150.21(!CDB) SV5.6
!CS0: IC147.11(Y4) IC149.16(!CSA)
!CS1: IC147.10(Y5) IC149.17(!CSB)
!CS2: IC147.9(Y6) IC150.16(!CSA)
!CS3: IC147.7(Y7) IC150.17(!CSB)
!CTS0: IC149.40(!CTSA) IC151.9(R2OUT)
!CTS1: IC149.28(!CTSB) IC152.9(R2OUT)
!CTS2: IC150.40(!CTSA) IC153.9(R2OUT)
!CTS3: IC150.28(!CTSB)
!DSR0: IC149.41(!DSRA)
!DSR1: IC149.25(!DSRB)
!DSR2: IC150.41(!DSRA)
!DSR3: IC150.25(!DSRB)
!DTR0: IC149.37(!DTRA)
!DTR1: IC149.38(!DTRB)
!DTR2: IC150.37(!DTRA)
!DTR3: IC150.38(!DTRB)
!INTRN0: IC148.2(A:O) IC148.4(B:O) SV3.1 SV3.3 SV3.5 SV3.7 SV3.9 SV3.11 SV3.13 SV3.15 SV3.17
!INTRN1: IC148.6(C:O) IC148.8(D:O) SV4.1 SV4.3 SV4.5 SV4.7 SV4.9 SV4.11 SV4.13 SV4.15 SV4.17
!IRQ: SV3.2 SV4.2 ; also sheet 11,22,26,27,28,29,30,44,47
!IRQ0: SV3.18 SV4.18 ; also sheet 22,27,30,44,45,46
!IRQ1: SV3.16 SV4.16 ; also sheet 22,27,30,44,45,46
!IRQ2: SV3.14 SV4.14 ; also sheet 22,27,29,30,44,45,46,47
!IRQ3: SV3.12 SV4.12 ; also sheet 22,29,30,44,45,46,47
!IRQ4: SV3.10 SV4.10 ; also sheet 22,29,30,44,45,46,47
!IRQ5: SV3.8 SV4.8 ; also sheet 22,26,28,30,44,45,46
!IRQ6: SV3.6 SV4.6 ; also sheet 22,26,28,30,44,45,46
!IRQ7: SV3.4 SV4.4 ; also sheet 22,26,28,30,44,45,46
!OPTWO0: IC149.35(!OP2A)
!OPTWO1: IC149.15(!OP2B)
!OPTWO2: IC150.35(!OP2A)
!OPTWO3: IC150.15(!OP2B)
!R: IC149.24(!IOR) IC150.24(!IOR) ; also sheet 4,5,6,12,22,24,26,27,28,29,30,41,42,44,45,46,47,48
!RESET: IC148.11(E:I) ; also sheet 2,3,4,7,8,10,11,12,13,14,17,18,19,20,21,22,26,28,29,30,31,44,45,46,47
!RI0: IC149.43(!RIA)
!RI1: IC149.26(!RIB)
!RI2: IC150.43(!RIA)
!RI3: IC150.26(!RIB)
!RTS0: IC149.36(!RTSA) IC151.10(T2IN)
!RTS1: IC149.27(!RTSB) IC152.10(T2IN)
!RTS2: IC150.36(!RTSA) IC153.10(T2IN)
!RTS3: IC150.27(!RTSB) SV5.2
!RXRDY0: IC149.34(!RXRDYA)
!RXRDY1: IC149.23(!RXRDYB)
!RXRDY2: IC150.34(!RXRDYA)
!RXRDY3: IC150.23(!RXRDYB)
!SYSDEV: IC147.5(G2B) ; also sheet 13,21,22,26,27,28,29,30,41,44,45,46
!TXRDY0: IC149.1(!TXRDYA)
!TXRDY1: IC149.12(!TXRDYB)
!TXRDY2: IC150.1(!TXRDYA)
!TXRDY3: IC150.12(!TXRDYB)
!W: IC149.20(!IOW) IC150.20(!IOW) ; also sheet 12,21,22,24,26,27,28,29,30,41,44,45,46,47,48
AB0: IC149.31(A0) IC150.31(A0) ; also sheet 13,21,24,26,27,28,29,30,41,44,45,46,47,48
AB1: IC149.30(A1) IC150.30(A1) ; also sheet 13,21,24,26,27,28,29,30,41,44,45,46,47,48
AB2: IC149.29(A2) IC150.29(A2) ; also sheet 13,21,24,26,27,29,30,41,44,45,46,47,48
AB3: IC147.1(A) ; also sheet 13,24,26,27,28,29,30,41,44,45,46,47,48
AB4: IC147.2(B) ; also sheet 13,22,24,26,27,28,29,30,41,44,45,46,47,48
AB5: IC147.3(C) ; also sheet 13,21,22,24,26,27,28,29,30,41,44,45,46,47,48
AB6: IC147.6(G1) ; also sheet 13,21,22,24,26,27,28,29,30,41,44,45,46,47,48
AB7: IC147.4(G2A) ; also sheet 13,21,22,24,26,27,28,29,30,41,44,45,46,47,48
CTS0: CON9.8 IC151.8(R2IN)
CTS1: CON10.8 IC152.8(R2IN)
CTS2: CON11.7 IC153.8(R2IN)
DB0: IC149.9(D7) IC150.9(D7) ; also sheet 12,21,22,24,26,27,28,29,30,31,41,44,45,46,47,48
DB1: IC149.8(D6) IC150.8(D6) ; also sheet 12,21,22,24,26,27,28,29,30,31,41,44,45,46,47,48
DB2: IC149.7(D5) IC150.7(D5) ; also sheet 12,21,22,24,26,27,28,29,30,31,41,44,45,46,47,48
DB3: IC149.6(D4) IC150.6(D4) ; also sheet 12,21,22,24,26,27,28,29,30,31,41,44,45,46,47,48
DB4: IC149.5(D3) IC150.5(D3) ; also sheet 12,21,22,24,26,27,28,29,30,31,41,44,45,46,47,48
DB5: IC149.4(D2) IC150.4(D2) ; also sheet 12,21,22,24,26,27,28,29,30,31,41,44,45,46,47,48
DB6: IC149.3(D1) IC150.3(D1) ; also sheet 12,21,22,24,26,27,28,29,30,31,41,44,45,46,47,48
DB7: IC149.2(D0) IC150.2(D0) ; also sheet 12,21,22,24,26,27,28,29,30,31,41,44,45,46,47,48
GND [low power]: C168.1 C169.1 C170.2 C171.1 C172.2 C173.2 C183.+ C184.+ C185.+ C186.- C187.- C188.- CON9.5 CON10.5 CON11.5 IC148.13(F:I) R36.1 R37.1 R38.1 R39.1 SV5.1 XTAL2.4(GND) XTAL2.7(GND1) ; also sheet 2,3,4,5,6,7,8,9,10,11,12,13,14,15,16,17,18,19,20,21,22,24,26,27,28,29,30,31,32,33,34,35,36,37,38,39,40,41,42,43,44,45,46,47,48,49
GND5: R41.1 R42.1 R43.1 ; supply symbol labelled EARTH
INT0: IC148.1(A:I) IC149.33(INTA) R36.2
INT1: IC148.3(B:I) IC149.32(INTB) R38.2
INT2: IC148.5(C:I) IC150.33(INTA) R39.2
INT3: IC148.9(D:I) IC150.32(INTB) R37.2
N$828: CON9.G1 CON9.G2 R41.2
N$829: C174.+ IC151.1(C1+)
N$830: C174.- IC151.3(C1-)
N$831: C175.+ IC151.4(C2+)
N$832: C175.- IC151.5(C2-)
N$833: C183.- IC151.6(V-)
N$834: C180.+ IC151.2(V+)
N$835: CON10.G1 CON10.G2 R42.2
N$836: C176.+ IC152.1(C1+)
N$837: C176.- IC152.3(C1-)
N$838: C177.+ IC152.4(C2+)
N$839: C177.- IC152.5(C2-)
N$840: C184.- IC152.6(V-)
N$841: C181.+ IC152.2(V+)
N$850: CON11.G1 CON11.G2 R43.2
N$851: C178.+ IC153.1(C1+)
N$852: C178.- IC153.3(C1-)
N$853: C179.+ IC153.4(C2+)
N$854: C179.- IC153.5(C2-)
N$855: C185.- IC153.6(V-)
N$856: C182.+ IC153.2(V+)
RTS0: CON9.7 IC151.7(T2OUT)
RTS1: CON10.7 IC152.7(T2OUT)
RTS2: CON11.8 IC153.7(T2OUT)
RX0: IC149.11(RXA) IC151.12(R1OUT)
RX1: IC149.10(RXB) IC152.12(R1OUT)
RX2: IC150.11(RXA)
RX3: IC150.10(RXB) SV5.4
RXD0: CON9.2 IC151.13(R1IN)
RXD1: CON10.2 IC152.13(R1IN)
RXD2: CON11.3 IC153.13(R1IN)
TX0: IC149.13(TXA) IC151.11(T1IN)
TX1: IC149.14(TXB) IC152.11(T1IN)
TX2: IC150.13(TXA) IC153.11(T1IN) IC153.12(R1OUT)
TX3: IC150.14(TXB) SV5.5
TXD0: CON9.3 IC151.14(T1OUT)
TXD1: CON10.3 IC152.14(T1OUT)
TXD2: CON11.2 IC153.14(T1OUT)
UARTCLK: IC149.18(XTAL1) IC150.18(XTAL1) XTAL2.8(OUT) XTAL2.11(OUT1)
UARTRST: IC148.10(E:O) IC149.39(RESET) IC150.39(RESET) R40.1
VCC [low power]: C168.2 C169.2 C170.1 C171.2 C172.1 C173.1 C180.- C181.- C182.- C186.+ C187.+ C188.+ R40.2 XTAL2.14(VCC) ; also sheet 2,3,4,6,7,8,9,10,11,12,13,14,15,16,17,18,19,20,21,22,24,26,27,28,29,30,31,34,35,36,37,38,39,40,41,42,43,44,45,46,47,48,49
Unconnected: CON9.1 CON9.4 CON9.6 CON9.9 CON10.1 CON10.4 CON10.6 CON10.9 CON11.1 CON11.4 CON11.6 CON11.9 IC147.12(Y3) IC147.13(Y2) IC147.14(Y1) IC147.15(Y0) IC148.12(F:O) IC149.19(XTAL2) IC150.19(XTAL2) SV5.3 XTAL2.1(TS)

### Buses
DB[0..15]
AB[0..15]
!IRQ[0..7]
UART0
UART1
UART2
!CS[0..3]
!RXRDY[0..3],!TXRDY[0..3],RX[0..3],TX[0..3],!CD[0..3],!CTS[0..3],!DSR[0..3],!RI[0..3],!RTS[0..3],!DTR[0..3],!OPTWO[0..3]

### Notes on the sheet
- CD | DSR
- DTR | RI
- GND
- Open drain inverting buffer
- configured as NOT gate. | DTE
- DB9 male or 2x5 pin header.
- &0040
- &0048
- &0050
- &0058 | CD | DSR
- &0060
- &0068
- &0070 | DTR
- &0078 | GND | RI
- Addresses Decoding: | DTE
- 0000'0000'0110'XXXX (&006X) -> Chip #0 (UARTs 0, 1) | DB9 male or 2x5 pin header.
- 0000'0000'0111'XXXX (&007X) -> Chip #1 (UARTs 2, 3)
- 0000'0000'01AA'AXXX = &004X - &007F
- CD
- DSR
- DTR
- GND | RI
- DCE
- DB9 female or 2x5 pin header.
- Attention: DCE wiring!
- FT232 Serial cable pinout
- DTR
- RXI (INPUT TTL to USB)
- TXO (OUTPUT USB to TTL)
- 3V3/5V Power input
- CTS
- TODO:
- TTL (e.g FT232 5V cable) | * DRC
- Decoupling
- U

## Sheet 26 of 49
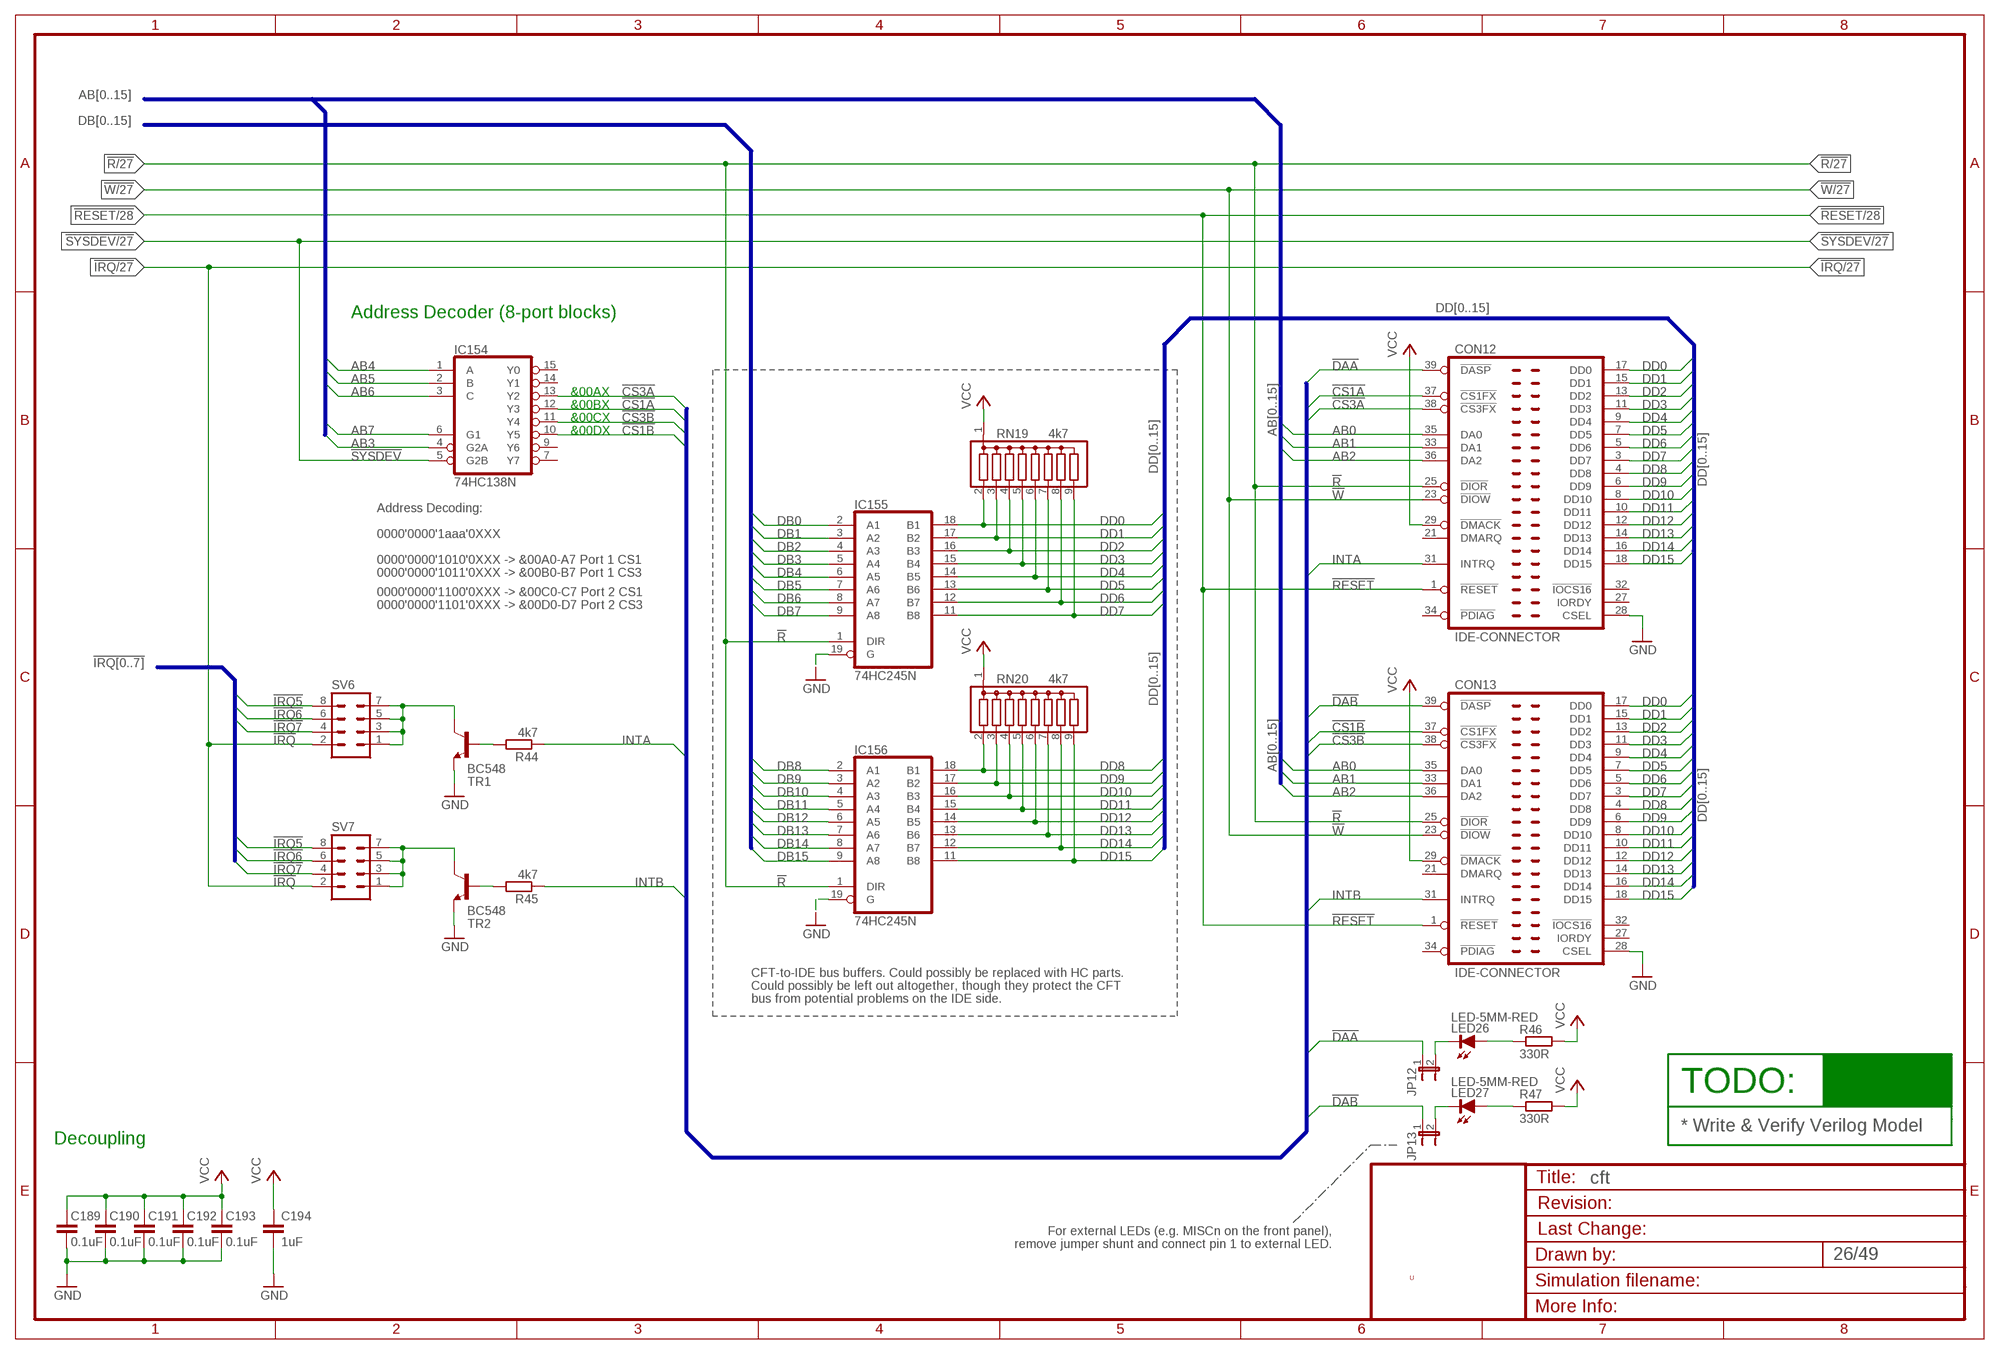
[diagram p25: schematic, sheet 26]

### Parts
C189  0.1uF  C-EU025-024X044  [C025-024X044]
C190  0.1uF  C-EU025-024X044  [C025-024X044]
C191  0.1uF  C-EU025-024X044  [C025-024X044]
C192  0.1uF  C-EU025-024X044  [C025-024X044]
C193  0.1uF  C-EU025-024X044  [C025-024X044]
C194  1uF  C-EU025-024X044  [C025-024X044]
CON12  IDE-CONNECTOR  [MA20-2]
CON13  IDE-CONNECTOR  [MA20-2]
IC154  74HC138N  [DIL16]
IC155  74HC245N  [DIL20]
IC156  74HC245N  [DIL20]
JP12  JP1E  [JP1]
JP13  JP1E  [JP1]
LED26  LED-5MM-RED  [LED5MM]
LED27  LED-5MM-RED  [LED5MM]
R44  4k7  R-EU_0204/7  [0204/7]
R45  4k7  R-EU_0204/7  [0204/7]
R46  330R  R-EU_0204/7  [0204/7]
R47  330R  R-EU_0204/7  [0204/7]
RN19  4k7  G08R  [SIL9]
RN20  4k7  G08R  [SIL9]
SV6  MA04-2  [MA04-2]
SV7  MA04-2  [MA04-2]
TR1  BC548  [TO92-EBC]
TR2  BC548  [TO92-EBC]

### Nets
!CS1A: CON12.37(!CS1FX) IC154.12(Y3)
!CS1B: CON13.37(!CS1FX) IC154.10(Y5)
!CS3A: CON12.38(!CS3FX) IC154.13(Y2)
!CS3B: CON13.38(!CS3FX) IC154.11(Y4)
!DAA: CON12.39(!DASP) JP12.1
!DAB: CON13.39(!DASP) JP13.1
!IRQ: SV6.2 SV7.2 ; also sheet 11,22,25,27,28,29,30,44,47
!IRQ5: SV6.8 SV7.8 ; also sheet 22,25,28,30,44,45,46
!IRQ6: SV6.6 SV7.6 ; also sheet 22,25,28,30,44,45,46
!IRQ7: SV6.4 SV7.4 ; also sheet 22,25,28,30,44,45,46
!R: CON12.25(!DIOR) CON13.25(!DIOR) IC155.1(DIR) IC156.1(DIR) ; also sheet 4,5,6,12,22,24,25,27,28,29,30,41,42,44,45,46,47,48
!RESET: CON12.1(!RESET) CON13.1(!RESET) ; also sheet 2,3,4,7,8,10,11,12,13,14,17,18,19,20,21,22,25,28,29,30,31,44,45,46,47
!SYSDEV: IC154.5(G2B) ; also sheet 13,21,22,25,27,28,29,30,41,44,45,46
!W: CON12.23(!DIOW) CON13.23(!DIOW) ; also sheet 12,21,22,24,25,27,28,29,30,41,44,45,46,47,48
AB0: CON12.35(DA0) CON13.35(DA0) ; also sheet 13,21,24,25,27,28,29,30,41,44,45,46,47,48
AB1: CON12.33(DA1) CON13.33(DA1) ; also sheet 13,21,24,25,27,28,29,30,41,44,45,46,47,48
AB2: CON12.36(DA2) CON13.36(DA2) ; also sheet 13,21,24,25,27,29,30,41,44,45,46,47,48
AB3: IC154.4(G2A) ; also sheet 13,24,25,27,28,29,30,41,44,45,46,47,48
AB4: IC154.1(A) ; also sheet 13,22,24,25,27,28,29,30,41,44,45,46,47,48
AB5: IC154.2(B) ; also sheet 13,21,22,24,25,27,28,29,30,41,44,45,46,47,48
AB6: IC154.3(C) ; also sheet 13,21,22,24,25,27,28,29,30,41,44,45,46,47,48
AB7: IC154.6(G1) ; also sheet 13,21,22,24,25,27,28,29,30,41,44,45,46,47,48
DB0: IC155.2(A1) ; also sheet 12,21,22,24,25,27,28,29,30,31,41,44,45,46,47,48
DB1: IC155.3(A2) ; also sheet 12,21,22,24,25,27,28,29,30,31,41,44,45,46,47,48
DB2: IC155.4(A3) ; also sheet 12,21,22,24,25,27,28,29,30,31,41,44,45,46,47,48
DB3: IC155.5(A4) ; also sheet 12,21,22,24,25,27,28,29,30,31,41,44,45,46,47,48
DB4: IC155.6(A5) ; also sheet 12,21,22,24,25,27,28,29,30,31,41,44,45,46,47,48
DB5: IC155.7(A6) ; also sheet 12,21,22,24,25,27,28,29,30,31,41,44,45,46,47,48
DB6: IC155.8(A7) ; also sheet 12,21,22,24,25,27,28,29,30,31,41,44,45,46,47,48
DB7: IC155.9(A8) ; also sheet 12,21,22,24,25,27,28,29,30,31,41,44,45,46,47,48
DB8: IC156.2(A1) ; also sheet 12,21,24,27,29,30,31,41,44,45,46,48
DB9: IC156.3(A2) ; also sheet 12,24,27,29,30,41,44,45,46,48
DB10: IC156.4(A3) ; also sheet 12,24,27,29,30,41,44,45,46,48
DB11: IC156.5(A4) ; also sheet 12,24,27,29,30,41,44,45,46,48
DB12: IC156.6(A5) ; also sheet 12,24,27,29,30,41,44,45,46,48
DB13: IC156.7(A6) ; also sheet 12,24,27,29,30,41,44,45,46,48
DB14: IC156.8(A7) ; also sheet 12,24,27,29,30,41,44,45,46,48
DB15: IC156.9(A8) ; also sheet 12,24,27,29,30,41,44,45,46,48
DD0: CON12.17(DD0) CON13.17(DD0) IC155.18(B1) RN19.2
DD1: CON12.15(DD1) CON13.15(DD1) IC155.17(B2) RN19.3
DD2: CON12.13(DD2) CON13.13(DD2) IC155.16(B3) RN19.4
DD3: CON12.11(DD3) CON13.11(DD3) IC155.15(B4) RN19.5
DD4: CON12.9(DD4) CON13.9(DD4) IC155.14(B5) RN19.6
DD5: CON12.7(DD5) CON13.7(DD5) IC155.13(B6) RN19.7
DD6: CON12.5(DD6) CON13.5(DD6) IC155.12(B7) RN19.8
DD7: CON12.3(DD7) CON13.3(DD7) IC155.11(B8) RN19.9
DD8: CON12.4(DD8) CON13.4(DD8) IC156.18(B1) RN20.2
DD9: CON12.6(DD9) CON13.6(DD9) IC156.17(B2) RN20.3
DD10: CON12.8(DD10) CON13.8(DD10) IC156.16(B3) RN20.4
DD11: CON12.10(DD11) CON13.10(DD11) IC156.15(B4) RN20.5
DD12: CON12.12(DD12) CON13.12(DD12) IC156.14(B5) RN20.6
DD13: CON12.14(DD13) CON13.14(DD13) IC156.13(B6) RN20.7
DD14: CON12.16(DD14) CON13.16(DD14) IC156.12(B7) RN20.8
DD15: CON12.18(DD15) CON13.18(DD15) IC156.11(B8) RN20.9
GND [low power]: C189.1 C190.1 C191.1 C192.1 C193.1 C194.2 CON12.28(CSEL) CON13.28(CSEL) IC155.19(G) IC156.19(G) TR1.E TR2.E ; also sheet 2,3,4,5,6,7,8,9,10,11,12,13,14,15,16,17,18,19,20,21,22,24,25,27,28,29,30,31,32,33,34,35,36,37,38,39,40,41,42,43,44,45,46,47,48,49
INTA: CON12.31(INTRQ) R44.1
INTB: CON13.31(INTRQ) R45.1
N$260: SV6.1 SV6.3 SV6.5 SV6.7 TR1.C
N$261: SV7.1 SV7.3 SV7.5 SV7.7 TR2.C
N$262: JP12.2 LED26.K(C)
N$263: JP13.2 LED27.K(C)
N$264: LED26.A R46.1
N$265: LED27.A R47.1
N$843: R44.2 TR1.B
N$844: R45.2 TR2.B
VCC [low power]: C189.2 C190.2 C191.2 C192.2 C193.2 C194.1 CON12.29(!DMACK) CON13.29(!DMACK) R46.2 R47.2 RN19.1 RN20.1 ; also sheet 2,3,4,6,7,8,9,10,11,12,13,14,15,16,17,18,19,20,21,22,24,25,27,28,29,30,31,34,35,36,37,38,39,40,41,42,43,44,45,46,47,48,49
Unconnected: CON12.20(KEY) CON12.21(DMARQ) CON12.27(IORDY) CON12.32(!IOCS16) CON12.34(!PDIAG) CON13.20(KEY) CON13.21(DMARQ) CON13.27(IORDY) CON13.32(!IOCS16) CON13.34(!PDIAG) IC154.7(Y7) IC154.9(Y6) IC154.14(Y1) IC154.15(Y0)

### Buses
DD[0..15]
DB[0..15]
AB[0..15]
!IRQ[0..7]
IDECTL:!CS1A,!CS3A,!CS1B,!CS3B,!DAA,!DAB,INTA,INTB

### Notes on the sheet
- Address Decoder (8-port blocks)
- &00AX
- &00BX
- &00CX
- &00DX
- Address Decoding:
- 0000'0000'1aaa'0XXX
- 0000'0000'1010'0XXX -> &00A0-A7 Port 1 CS1
- 0000'0000'1011'0XXX -> &00B0-B7 Port 1 CS3
- 0000'0000'1100'0XXX -> &00C0-C7 Port 2 CS1
- 0000'0000'1101'0XXX -> &00D0-D7 Port 2 CS3
- CFT-to-IDE bus buffers. Could possibly be replaced with HC parts.
- Could possibly be left out altogether, though they protect the CFT
- bus from potential problems on the IDE side.
- TODO:
- * Write & Verify Verilog Model
- Decoupling
- For external LEDs (e.g. MISCn on the front panel),
- remove jumper shunt and connect pin 1 to external LED.
- U

## Sheet 27 of 49
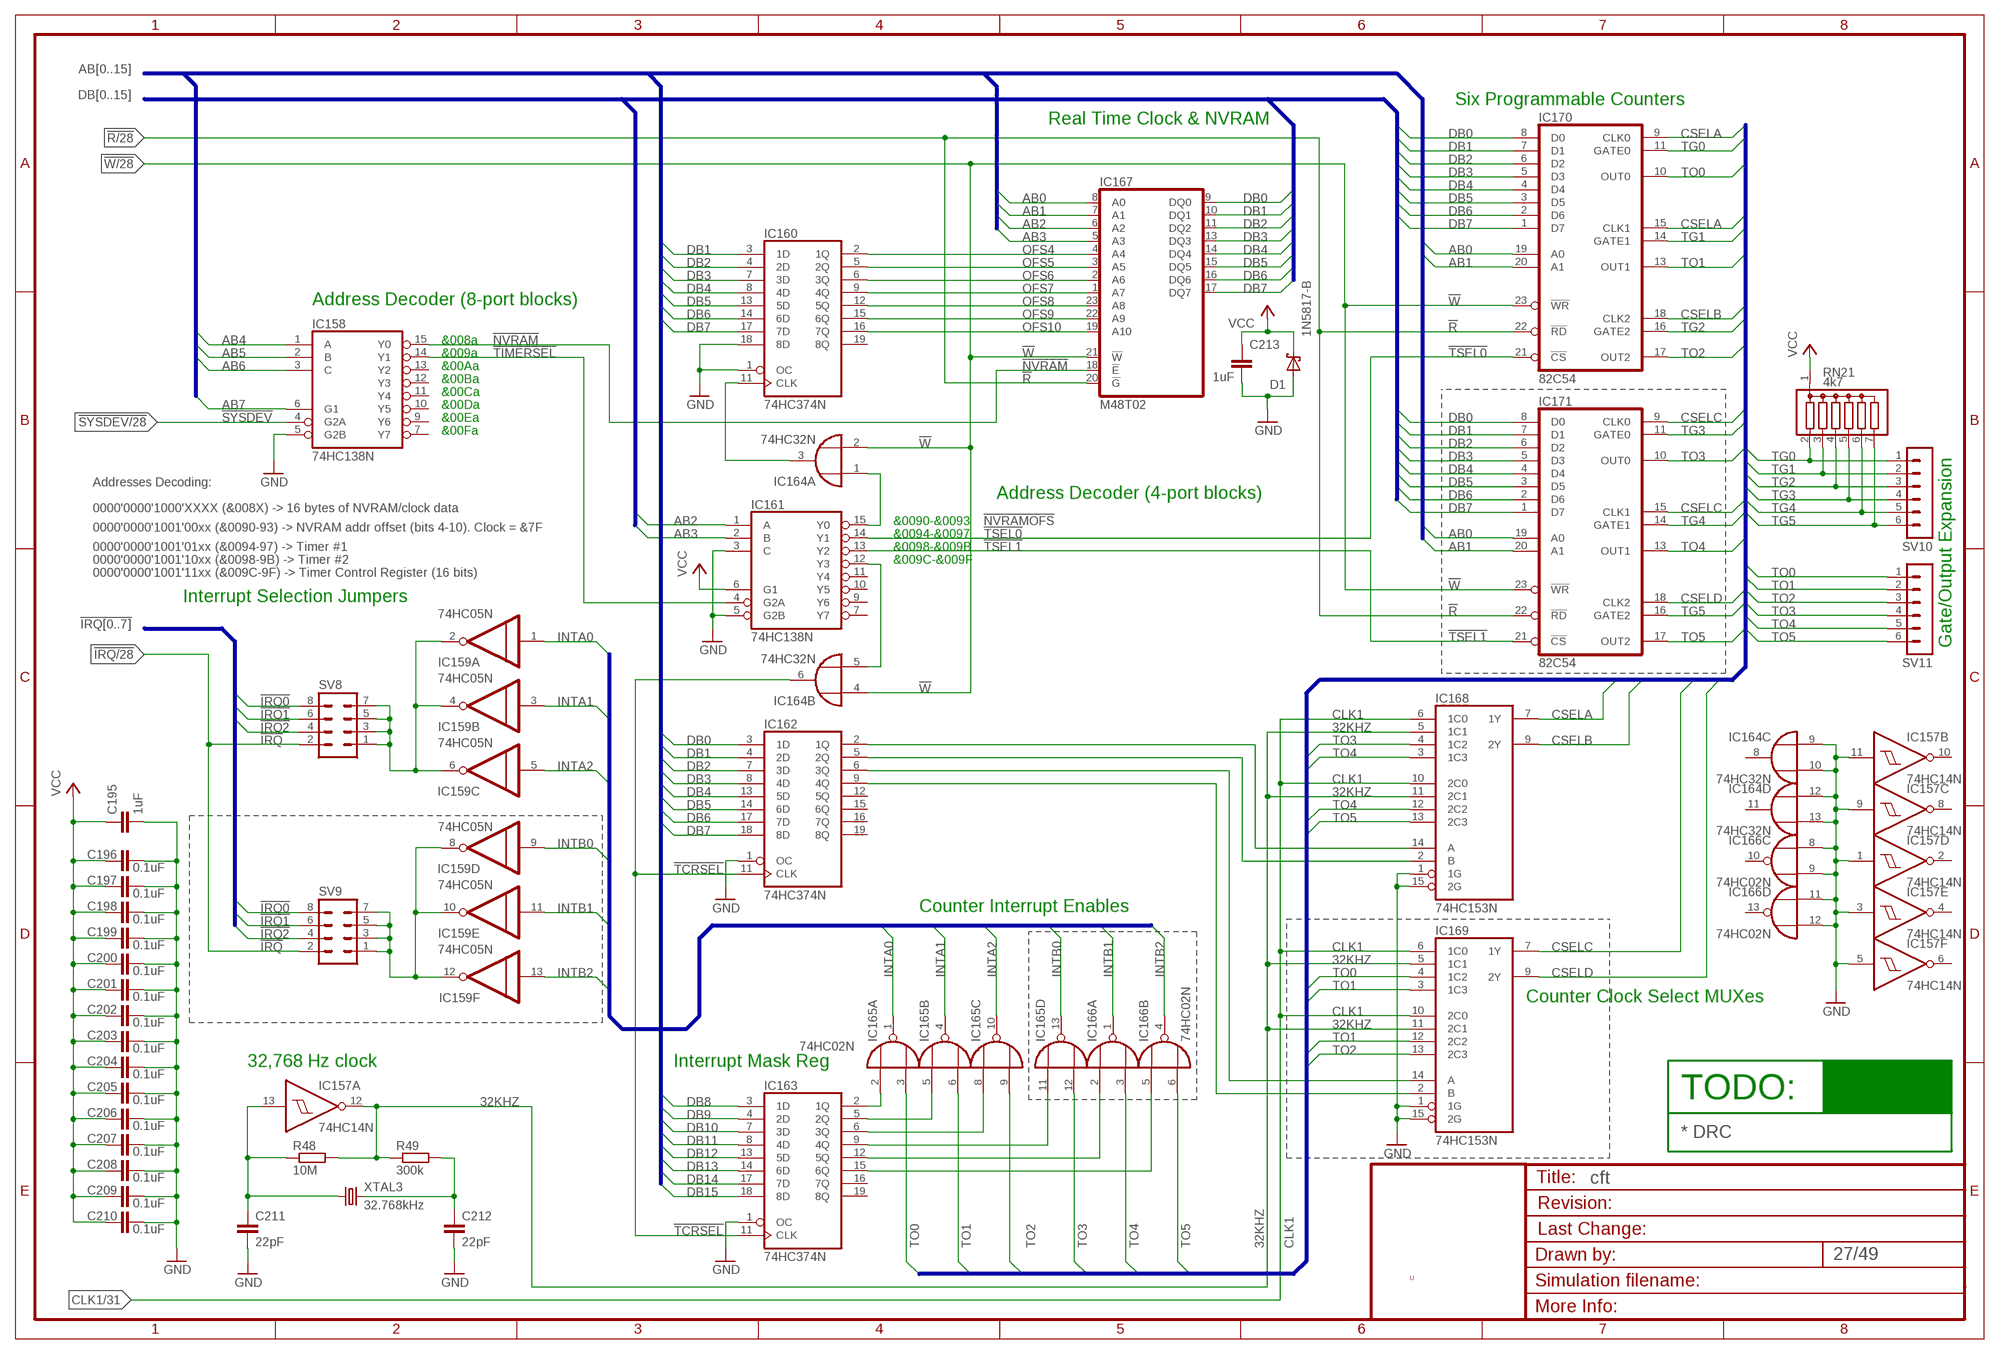
[diagram p26: schematic, sheet 27]

### Parts
C195  1uF  C-EU025-024X044  [C025-024X044]
C196  0.1uF  C-EU025-024X044  [C025-024X044]
C197  0.1uF  C-EU025-024X044  [C025-024X044]
C198  0.1uF  C-EU025-024X044  [C025-024X044]
C199  0.1uF  C-EU025-024X044  [C025-024X044]
C200  0.1uF  C-EU025-024X044  [C025-024X044]
C201  0.1uF  C-EU025-024X044  [C025-024X044]
C202  0.1uF  C-EU025-024X044  [C025-024X044]
C203  0.1uF  C-EU025-024X044  [C025-024X044]
C204  0.1uF  C-EU025-024X044  [C025-024X044]
C205  0.1uF  C-EU025-024X044  [C025-024X044]
C206  0.1uF  C-EU025-024X044  [C025-024X044]
C207  0.1uF  C-EU025-024X044  [C025-024X044]
C208  0.1uF  C-EU025-024X044  [C025-024X044]
C209  0.1uF  C-EU025-024X044  [C025-024X044]
C210  0.1uF  C-EU025-024X044  [C025-024X044]
C211  22pF  C-EU025-024X044  [C025-024X044]
C212  22pF  C-EU025-024X044  [C025-024X044]
C213  1uF  C-EU025-024X044  [C025-024X044]
D1  1N5817-B  [DO41-7.6]
IC157  74HC14N  [DIL14]
IC158  74HC138N  [DIL16]
IC159  74HC05N  [DIL14]
IC160  74HC374N  [DIL20]
IC161  74HC138N  [DIL16]
IC162  74HC374N  [DIL20]
IC163  74HC374N  [DIL20]
IC164  74HC32N  [DIL14]
IC165  74HC02N  [DIL14]
IC166  74HC02N  [DIL14]
IC167  M48T02  [PDIP24-CAPHAT]
IC168  74HC153N  [DIL16]
IC169  74HC153N  [DIL16]
IC170  82C54  [DIL24]
IC171  82C54  [DIL24]
R48  10M  R-EU_0204/7  [0204/7]
R49  300k  R-EU_0204/7  [0204/7]
RN21  4k7  G06R  [SIL7]
SV8  MA04-2  [MA04-2]
SV9  MA04-2  [MA04-2]
SV10  MA06-1  [MA06-1]
SV11  MA06-1  [MA06-1]
XTAL3  32.768kHz  CRYSTALTC38H  [TC38H]

### Nets
32KHZ: IC157.12(A:O) IC168.5(1C1) IC168.11(2C1) IC169.5(1C1) IC169.11(2C1) R48.2 R49.1
!IRQ: SV8.2 SV9.2 ; also sheet 11,22,25,26,28,29,30,44,47
!IRQ0: SV8.8 SV9.8 ; also sheet 22,25,30,44,45,46
!IRQ1: SV8.6 SV9.6 ; also sheet 22,25,30,44,45,46
!IRQ2: SV8.4 SV9.4 ; also sheet 22,25,29,30,44,45,46,47
!NVRAM: IC158.15(Y0) IC167.18(!E)
!NVRAMOFS: IC161.15(Y0) IC164.1(A:I0)
!R: IC167.20(!G) IC170.22(!RD) IC171.22(!RD) ; also sheet 4,5,6,12,22,24,25,26,28,29,30,41,42,44,45,46,47,48
!SYSDEV: IC158.4(G2A) ; also sheet 13,21,22,25,26,28,29,30,41,44,45,46
!TCRSEL: IC162.11(CLK) IC163.11(CLK) IC164.6(B:O)
!TIMERSEL: IC158.14(Y1) IC161.4(G2A)
!TSEL0: IC161.14(Y1) IC170.21(!CS)
!TSEL1: IC161.13(Y2) IC171.21(!CS)
!W: IC164.2(A:I1) IC164.4(B:I0) IC167.21(!W) IC170.23(!WR) IC171.23(!WR) ; also sheet 12,21,22,24,25,26,28,29,30,41,44,45,46,47,48
AB0: IC167.8(A0) IC170.19(A0) IC171.19(A0) ; also sheet 13,21,24,25,26,28,29,30,41,44,45,46,47,48
AB1: IC167.7(A1) IC170.20(A1) IC171.20(A1) ; also sheet 13,21,24,25,26,28,29,30,41,44,45,46,47,48
AB2: IC161.1(A) IC167.6(A2) ; also sheet 13,21,24,25,26,29,30,41,44,45,46,47,48
AB3: IC161.2(B) IC167.5(A3) ; also sheet 13,24,25,26,28,29,30,41,44,45,46,47,48
AB4: IC158.1(A) ; also sheet 13,22,24,25,26,28,29,30,41,44,45,46,47,48
AB5: IC158.2(B) ; also sheet 13,21,22,24,25,26,28,29,30,41,44,45,46,47,48
AB6: IC158.3(C) ; also sheet 13,21,22,24,25,26,28,29,30,41,44,45,46,47,48
AB7: IC158.6(G1) ; also sheet 13,21,22,24,25,26,28,29,30,41,44,45,46,47,48
CLK1: IC168.6(1C0) IC168.10(2C0) IC169.6(1C0) IC169.10(2C0) ; also sheet 2,7,31,43,44,45,46
CSELA: IC168.7(1Y) IC170.9(CLK0) IC170.15(CLK1)
CSELB: IC168.9(2Y) IC170.18(CLK2)
CSELC: IC169.7(1Y) IC171.9(CLK0) IC171.15(CLK1)
CSELD: IC169.9(2Y) IC171.18(CLK2)
DB0: IC162.3(1D) IC167.9(DQ0) IC170.8(D0) IC171.8(D0) ; also sheet 12,21,22,24,25,26,28,29,30,31,41,44,45,46,47,48
DB1: IC160.3(1D) IC162.4(2D) IC167.10(DQ1) IC170.7(D1) IC171.7(D1) ; also sheet 12,21,22,24,25,26,28,29,30,31,41,44,45,46,47,48
DB2: IC160.4(2D) IC162.7(3D) IC167.11(DQ2) IC170.6(D2) IC171.6(D2) ; also sheet 12,21,22,24,25,26,28,29,30,31,41,44,45,46,47,48
DB3: IC160.7(3D) IC162.8(4D) IC167.13(DQ3) IC170.5(D3) IC171.5(D3) ; also sheet 12,21,22,24,25,26,28,29,30,31,41,44,45,46,47,48
DB4: IC160.8(4D) IC162.13(5D) IC167.14(DQ4) IC170.4(D4) IC171.4(D4) ; also sheet 12,21,22,24,25,26,28,29,30,31,41,44,45,46,47,48
DB5: IC160.13(5D) IC162.14(6D) IC167.15(DQ5) IC170.3(D5) IC171.3(D5) ; also sheet 12,21,22,24,25,26,28,29,30,31,41,44,45,46,47,48
DB6: IC160.14(6D) IC162.17(7D) IC167.16(DQ6) IC170.2(D6) IC171.2(D6) ; also sheet 12,21,22,24,25,26,28,29,30,31,41,44,45,46,47,48
DB7: IC160.17(7D) IC162.18(8D) IC167.17(DQ7) IC170.1(D7) IC171.1(D7) ; also sheet 12,21,22,24,25,26,28,29,30,31,41,44,45,46,47,48
DB8: IC163.3(1D) ; also sheet 12,21,24,26,29,30,31,41,44,45,46,48
DB9: IC163.4(2D) ; also sheet 12,24,26,29,30,41,44,45,46,48
DB10: IC163.7(3D) ; also sheet 12,24,26,29,30,41,44,45,46,48
DB11: IC163.8(4D) ; also sheet 12,24,26,29,30,41,44,45,46,48
DB12: IC163.13(5D) ; also sheet 12,24,26,29,30,41,44,45,46,48
DB13: IC163.14(6D) ; also sheet 12,24,26,29,30,41,44,45,46,48
DB14: IC163.17(7D) ; also sheet 12,24,26,29,30,41,44,45,46,48
DB15: IC163.18(8D) ; also sheet 12,24,26,29,30,41,44,45,46,48
GND [low power]: C195.2 C196.2 C197.2 C198.2 C199.2 C200.2 C201.2 C202.2 C203.2 C204.2 C205.2 C206.2 C207.2 C208.2 C209.2 C210.2 C211.2 C212.2 C213.2 D1.A IC157.1(D:I) IC157.3(E:I) IC157.5(F:I) IC157.9(C:I) IC157.11(B:I) IC158.5(G2B) IC160.1(OC) IC160.18(8D) IC161.3(C) IC161.5(G2B) IC162.1(OC) IC163.1(OC) IC164.9(C:I0) IC164.10(C:I1) IC164.12(D:I0) IC164.13(D:I1) IC166.8(C:I0) IC166.9(C:I1) IC166.11(D:I0) IC166.12(D:I1) IC168.1(1G) IC168.15(2G) IC169.1(1G) IC169.15(2G) ; also sheet 2,3,4,5,6,7,8,9,10,11,12,13,14,15,16,17,18,19,20,21,22,24,25,26,28,29,30,31,32,33,34,35,36,37,38,39,40,41,42,43,44,45,46,47,48,49
INTA0: IC159.1(A:I) IC165.1(A:O)
INTA1: IC159.3(B:I) IC165.4(B:O)
INTA2: IC159.5(C:I) IC165.10(C:O)
INTB0: IC159.9(D:I) IC165.13(D:O)
INTB1: IC159.11(E:I) IC166.1(A:O)
INTB2: IC159.13(F:I) IC166.4(B:O)
N$9: IC161.12(Y3) IC164.5(B:I1)
N$237: IC160.11(CLK) IC164.3(A:O)
N$239: C211.1 IC157.13(A:I) R48.1 XTAL3.1
N$240: IC162.2(1Q) IC168.14(A)
N$241: IC162.5(2Q) IC168.2(B)
N$242: IC162.6(3Q) IC169.14(A)
N$243: IC162.9(4Q) IC169.2(B)
N$244: C212.1 R49.2 XTAL3.2
N$251: IC163.2(1Q) IC165.2(A:I0)
N$252: IC163.5(2Q) IC165.5(B:I0)
N$253: IC163.6(3Q) IC165.8(C:I0)
N$254: IC163.9(4Q) IC165.11(D:I0)
N$255: IC163.12(5Q) IC166.2(A:I0)
N$256: IC163.15(6Q) IC166.5(B:I0)
N$257: IC159.2(A:O) IC159.4(B:O) IC159.6(C:O) SV8.1 SV8.3 SV8.5 SV8.7
N$870: IC159.8(D:O) IC159.10(E:O) IC159.12(F:O) SV9.1 SV9.3 SV9.5 SV9.7
OFS4: IC160.2(1Q) IC167.4(A4)
OFS5: IC160.5(2Q) IC167.3(A5)
OFS6: IC160.6(3Q) IC167.2(A6)
OFS7: IC160.9(4Q) IC167.1(A7)
OFS8: IC160.12(5Q) IC167.23(A8)
OFS9: IC160.15(6Q) IC167.22(A9)
OFS10: IC160.16(7Q) IC167.19(A10)
TG0: IC170.11(GATE0) RN21.2 SV10.1
TG1: IC170.14(GATE1) RN21.3 SV10.2
TG2: IC170.16(GATE2) RN21.4 SV10.3
TG3: IC171.11(GATE0) RN21.5 SV10.4
TG4: IC171.14(GATE1) RN21.6 SV10.5
TG5: IC171.16(GATE2) RN21.7 SV10.6
TO0: IC165.3(A:I1) IC169.4(1C2) IC170.10(OUT0) SV11.1
TO1: IC165.6(B:I1) IC169.3(1C3) IC169.12(2C2) IC170.13(OUT1) SV11.2
TO2: IC165.9(C:I1) IC169.13(2C3) IC170.17(OUT2) SV11.3
TO3: IC165.12(D:I1) IC168.4(1C2) IC171.10(OUT0) SV11.4
TO4: IC166.3(A:I1) IC168.3(1C3) IC168.12(2C2) IC171.13(OUT1) SV11.5
TO5: IC166.6(B:I1) IC168.13(2C3) IC171.17(OUT2) SV11.6
VCC [low power]: C195.1 C196.1 C197.1 C198.1 C199.1 C200.1 C201.1 C202.1 C203.1 C204.1 C205.1 C206.1 C207.1 C208.1 C209.1 C210.1 C213.1 D1.C IC161.6(G1) RN21.1 ; also sheet 2,3,4,6,7,8,9,10,11,12,13,14,15,16,17,18,19,20,21,22,24,25,26,28,29,30,31,34,35,36,37,38,39,40,41,42,43,44,45,46,47,48,49
Unconnected: IC157.2(D:O) IC157.4(E:O) IC157.6(F:O) IC157.8(C:O) IC157.10(B:O) IC158.7(Y7) IC158.9(Y6) IC158.10(Y5) IC158.11(Y4) IC158.12(Y3) IC158.13(Y2) IC160.19(8Q) IC161.7(Y7) IC161.9(Y6) IC161.10(Y5) IC161.11(Y4) IC162.12(5Q) IC162.15(6Q) IC162.16(7Q) IC162.19(8Q) IC163.16(7Q) IC163.19(8Q) IC164.8(C:O) IC164.11(D:O) IC166.10(C:O) IC166.13(D:O)

### Buses
DB[0..15]
AB[0..15]
!IRQ[0..7]
TIMERCTL:CSELA,CSELB,TG[0..5],TO[0..5]
INTA[0..2],INTB[0..2]

### Notes on the sheet
- Six Programmable Counters
- Real Time Clock & NVRAM
- Address Decoder (8-port blocks)
- &008a
- &009a
- &00Aa
- &00Ba
- &00Ca
- &00Da
- &00Ea
- &00Fa
- Addresses Decoding:
- Address Decoder (4-port blocks)
- 0000'0000'1000'XXXX (&008X) -> 16 bytes of NVRAM/clock data
- &0090-&0093
- 0000'0000'1001'00xx (&0090-93) -> NVRAM addr offset (bits 4-10). Clock = &7F
- &0094-&0097
- 0000'0000'1001'01xx (&0094-97) -> Timer #1 | &0098-&009B
- 0000'0000'1001'10xx (&0098-9B) -> Timer #2 | &009C-&009F
- 0000'0000'1001'11xx (&009C-9F) -> Timer Control Register (16 bits)
- Interrupt Selection Jumpers
- Gate/Output Expansion
- Counter Interrupt Enables
- Counter Clock Select MUXes
- 32,768 Hz clock | Interrupt Mask Reg
- TODO:
- * DRC
- U

## Sheet 28 of 49
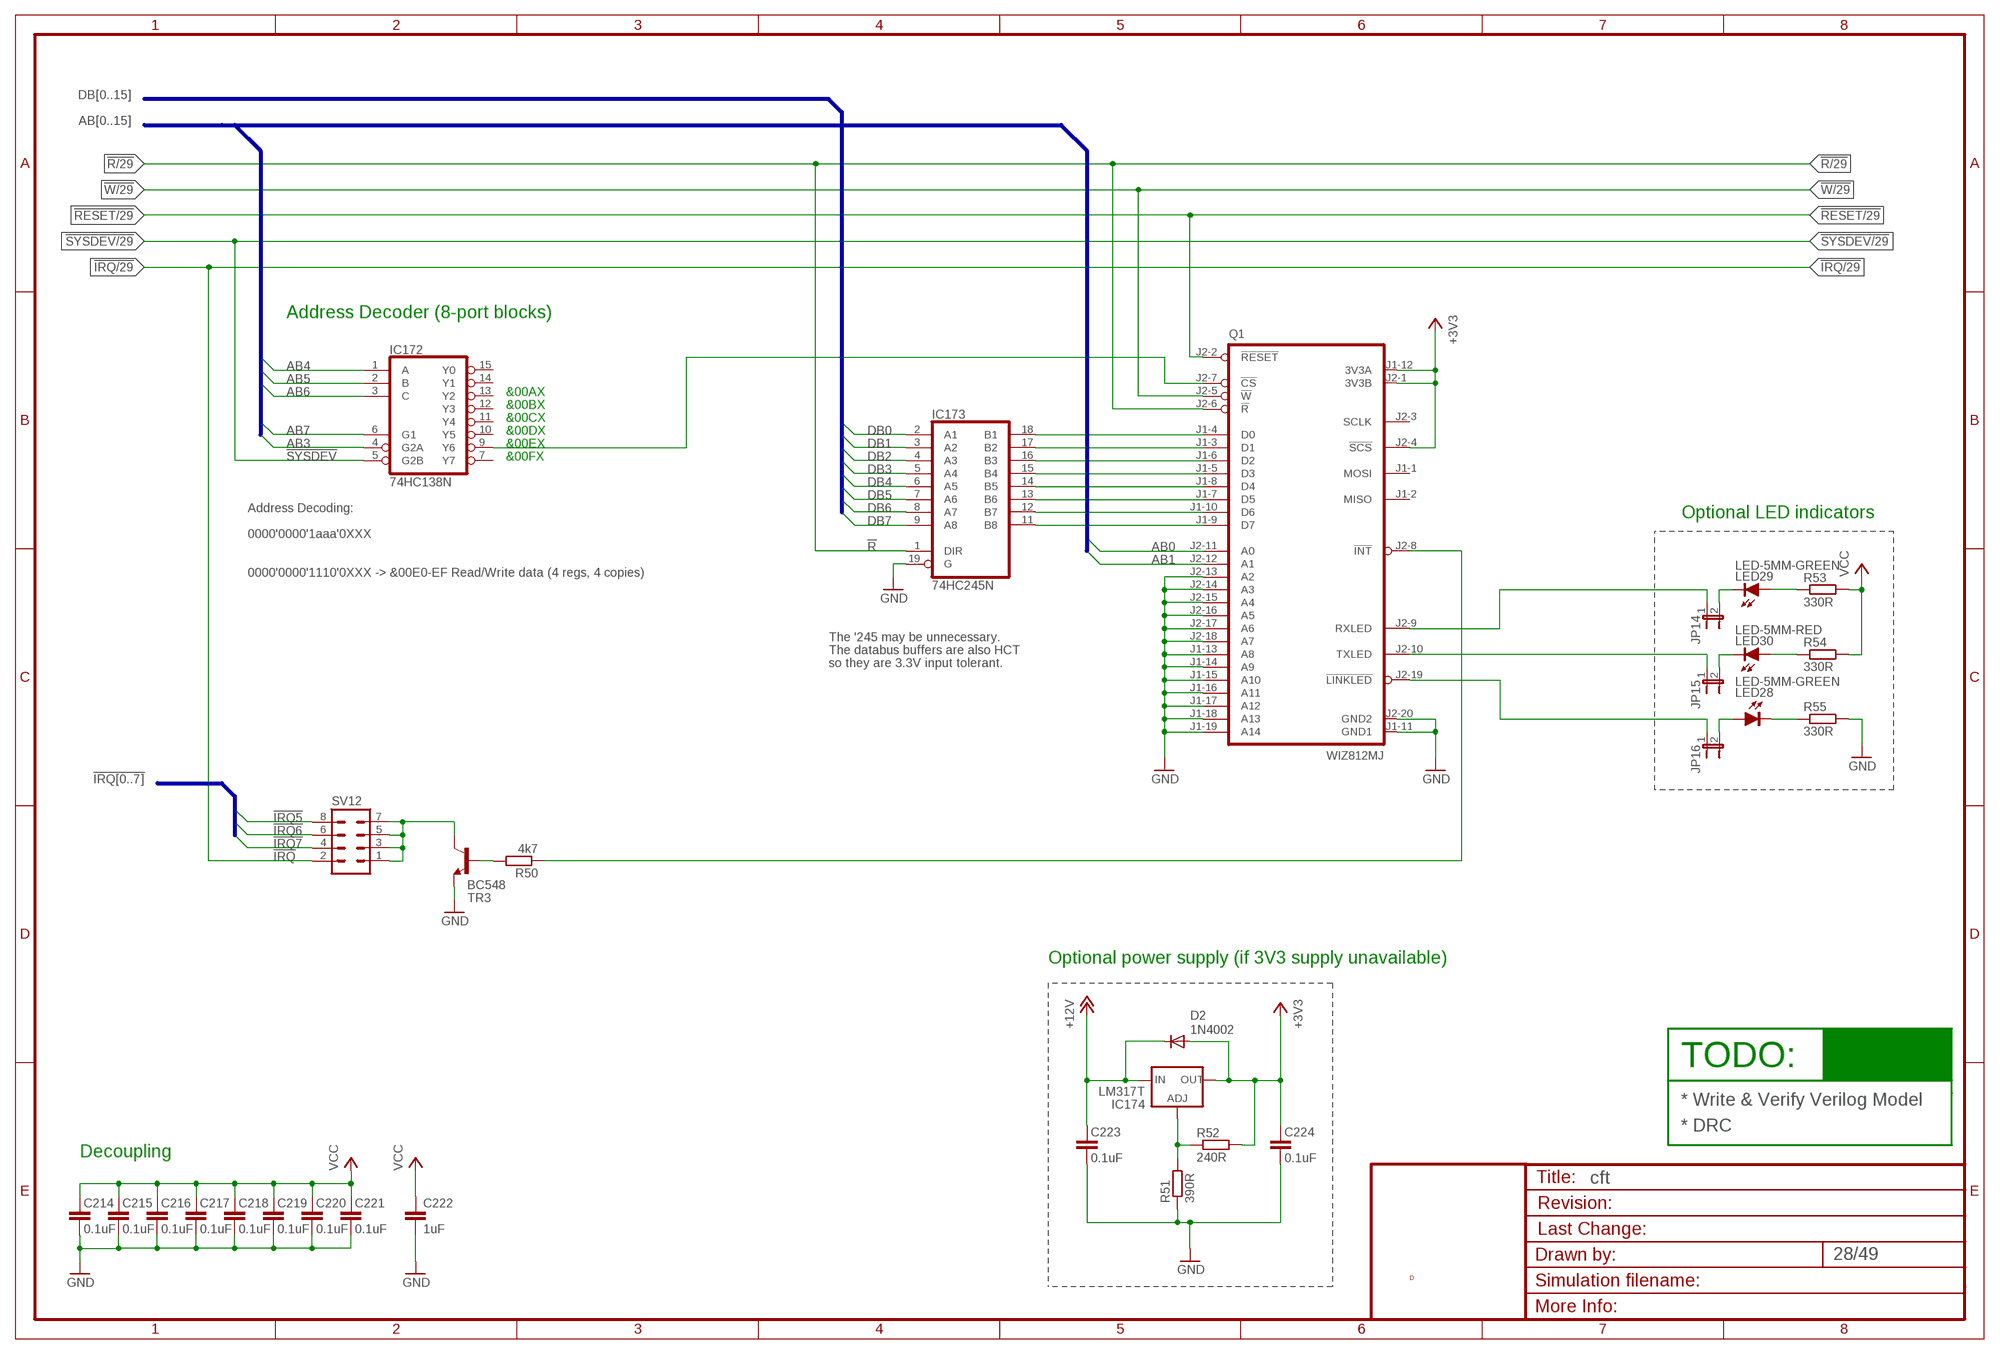
[diagram p27: schematic, sheet 28]

### Parts
C214  0.1uF  C-EU025-024X044  [C025-024X044]
C215  0.1uF  C-EU025-024X044  [C025-024X044]
C216  0.1uF  C-EU025-024X044  [C025-024X044]
C217  0.1uF  C-EU025-024X044  [C025-024X044]
C218  0.1uF  C-EU025-024X044  [C025-024X044]
C219  0.1uF  C-EU025-024X044  [C025-024X044]
C220  0.1uF  C-EU025-024X044  [C025-024X044]
C221  0.1uF  C-EU025-024X044  [C025-024X044]
C222  1uF  C-EU025-024X044  [C025-024X044]
C223  0.1uF  C-EU025-024X044  [C025-024X044]
C224  0.1uF  C-EU025-024X044  [C025-024X044]
D2  1N4002  DIODE-DO41-10  [DO41-10]
IC172  74HC138N  [DIL16]
IC173  74HC245N  [DIL20]
IC174  LM317T  V_REG_317SINK  [TO220-ADJ]
JP14  JP1E  [JP1]
JP15  JP1E  [JP1]
JP16  JP1E  [JP1]
LED28  LED-5MM-GREEN  [LED5MM]
LED29  LED-5MM-GREEN  [LED5MM]
LED30  LED-5MM-RED  [LED5MM]
Q1  WIZ812MJ  [WIZ812MJ]
R50  4k7  R-EU_0204/7  [0204/7]
R51  390R  R-EU_0207/7  [0207/7]
R52  240R  R-EU_0207/7  [0207/7]
R53  330R  R-EU_0204/7  [0204/7]
R54  330R  R-EU_0204/7  [0204/7]
R55  330R  R-EU_0204/7  [0204/7]
SV12  MA04-2  [MA04-2]
TR3  BC548  [TO92-EBC]

### Nets
!DAA1: JP14.1 Q1.J2-9(RXLED)
!DAB2: JP15.1 Q1.J2-10(TXLED)
!DAB3: JP16.1 Q1.J2-19(!LINKLED)
!IRQ: SV12.2 ; also sheet 11,22,25,26,27,29,30,44,47
!IRQ5: SV12.8 ; also sheet 22,25,26,30,44,45,46
!IRQ6: SV12.6 ; also sheet 22,25,26,30,44,45,46
!IRQ7: SV12.4 ; also sheet 22,25,26,30,44,45,46
!R: IC173.1(DIR) Q1.J2-6(!R) ; also sheet 4,5,6,12,22,24,25,26,27,29,30,41,42,44,45,46,47,48
!RESET: Q1.J2-2(!RESET) ; also sheet 2,3,4,7,8,10,11,12,13,14,17,18,19,20,21,22,25,26,29,30,31,44,45,46,47
!SYSDEV: IC172.5(G2B) ; also sheet 13,21,22,25,26,27,29,30,41,44,45,46
!W: Q1.J2-5(!W) ; also sheet 12,21,22,24,25,26,27,29,30,41,44,45,46,47,48
+3V3: C224.2 D2.A IC174.OUT Q1.J1-12(3V3A) Q1.J2-1(3V3B) Q1.J2-4(!SCS) R52.2
+12V [LED power]: C223.2 D2.C IC174.IN ; also sheet 44,45
AB0: Q1.J2-11(A0) ; also sheet 13,21,24,25,26,27,29,30,41,44,45,46,47,48
AB1: Q1.J2-12(A1) ; also sheet 13,21,24,25,26,27,29,30,41,44,45,46,47,48
AB3: IC172.4(G2A) ; also sheet 13,24,25,26,27,29,30,41,44,45,46,47,48
AB4: IC172.1(A) ; also sheet 13,22,24,25,26,27,29,30,41,44,45,46,47,48
AB5: IC172.2(B) ; also sheet 13,21,22,24,25,26,27,29,30,41,44,45,46,47,48
AB6: IC172.3(C) ; also sheet 13,21,22,24,25,26,27,29,30,41,44,45,46,47,48
AB7: IC172.6(G1) ; also sheet 13,21,22,24,25,26,27,29,30,41,44,45,46,47,48
DB0: IC173.2(A1) ; also sheet 12,21,22,24,25,26,27,29,30,31,41,44,45,46,47,48
DB1: IC173.3(A2) ; also sheet 12,21,22,24,25,26,27,29,30,31,41,44,45,46,47,48
DB2: IC173.4(A3) ; also sheet 12,21,22,24,25,26,27,29,30,31,41,44,45,46,47,48
DB3: IC173.5(A4) ; also sheet 12,21,22,24,25,26,27,29,30,31,41,44,45,46,47,48
DB4: IC173.6(A5) ; also sheet 12,21,22,24,25,26,27,29,30,31,41,44,45,46,47,48
DB5: IC173.7(A6) ; also sheet 12,21,22,24,25,26,27,29,30,31,41,44,45,46,47,48
DB6: IC173.8(A7) ; also sheet 12,21,22,24,25,26,27,29,30,31,41,44,45,46,47,48
DB7: IC173.9(A8) ; also sheet 12,21,22,24,25,26,27,29,30,31,41,44,45,46,47,48
GND [low power]: C214.1 C215.1 C216.1 C217.1 C218.1 C219.1 C220.1 C221.1 C222.2 C223.1 C224.1 IC173.19(G) Q1.J1-11(GND1) Q1.J1-13(A8) Q1.J1-14(A9) Q1.J1-15(A10) Q1.J1-16(A11) Q1.J1-17(A12) Q1.J1-18(A13) Q1.J1-19(A14) Q1.J2-13(A2) Q1.J2-14(A3) Q1.J2-15(A4) Q1.J2-16(A5) Q1.J2-17(A6) Q1.J2-18(A7) Q1.J2-20(GND2) R51.1 R55.2 TR3.E ; also sheet 2,3,4,5,6,7,8,9,10,11,12,13,14,15,16,17,18,19,20,21,22,24,25,26,27,29,30,31,32,33,34,35,36,37,38,39,40,41,42,43,44,45,46,47,48,49
N$890: SV12.1 SV12.3 SV12.5 SV12.7 TR3.C
N$891: JP14.2 LED29.K(C)
N$892: LED29.A R53.1
N$893: JP15.2 LED30.K(C)
N$894: LED30.A R54.1
N$895: R50.2 TR3.B
N$896 [LED power]: IC174.ADJ R51.2 R52.1
N$900: IC172.9(Y6) Q1.J2-7(!CS)
N$905: Q1.J2-8(!INT) R50.1
N$906: JP16.2 LED28.A
N$907: LED28.K(C) R55.1
N$908: IC173.11(B8) Q1.J1-9(D7)
N$909: IC173.12(B7) Q1.J1-10(D6)
N$910: IC173.13(B6) Q1.J1-7(D5)
N$911: IC173.14(B5) Q1.J1-8(D4)
N$912: IC173.15(B4) Q1.J1-5(D3)
N$913: IC173.16(B3) Q1.J1-6(D2)
N$914: IC173.17(B2) Q1.J1-3(D1)
N$915: IC173.18(B1) Q1.J1-4(D0)
VCC [low power]: C214.2 C215.2 C216.2 C217.2 C218.2 C219.2 C220.2 C221.2 C222.1 R53.2 R54.2 ; also sheet 2,3,4,6,7,8,9,10,11,12,13,14,15,16,17,18,19,20,21,22,24,25,26,27,29,30,31,34,35,36,37,38,39,40,41,42,43,44,45,46,47,48,49
Unconnected: IC172.7(Y7) IC172.10(Y5) IC172.11(Y4) IC172.12(Y3) IC172.13(Y2) IC172.14(Y1) IC172.15(Y0) Q1.J1-1(MOSI) Q1.J1-2(MISO) Q1.J2-3(SCLK)

### Buses
DB[0..15]
AB[0..15]
!IRQ[0..7]

### Notes on the sheet
- Address Decoder (8-port blocks)
- &00AX
- &00BX
- &00CX
- &00DX
- &00EX
- &00FX
- Address Decoding:
- Optional LED indicators
- 0000'0000'1aaa'0XXX
- 0000'0000'1110'0XXX -> &00E0-EF Read/Write data (4 regs, 4 copies)
- The '245 may be unnecessary.
- The databus buffers are also HCT
- so they are 3.3V input tolerant.
- Optional power supply (if 3V3 supply unavailable)
- TODO:
- * Write & Verify Verilog Model
- * DRC
- Decoupling
- D